# Altium project PROC114E3_SCH.PrjPcb (part 19 of 22)

## Sheet 37.SchDoc
size 513 x 386 mm
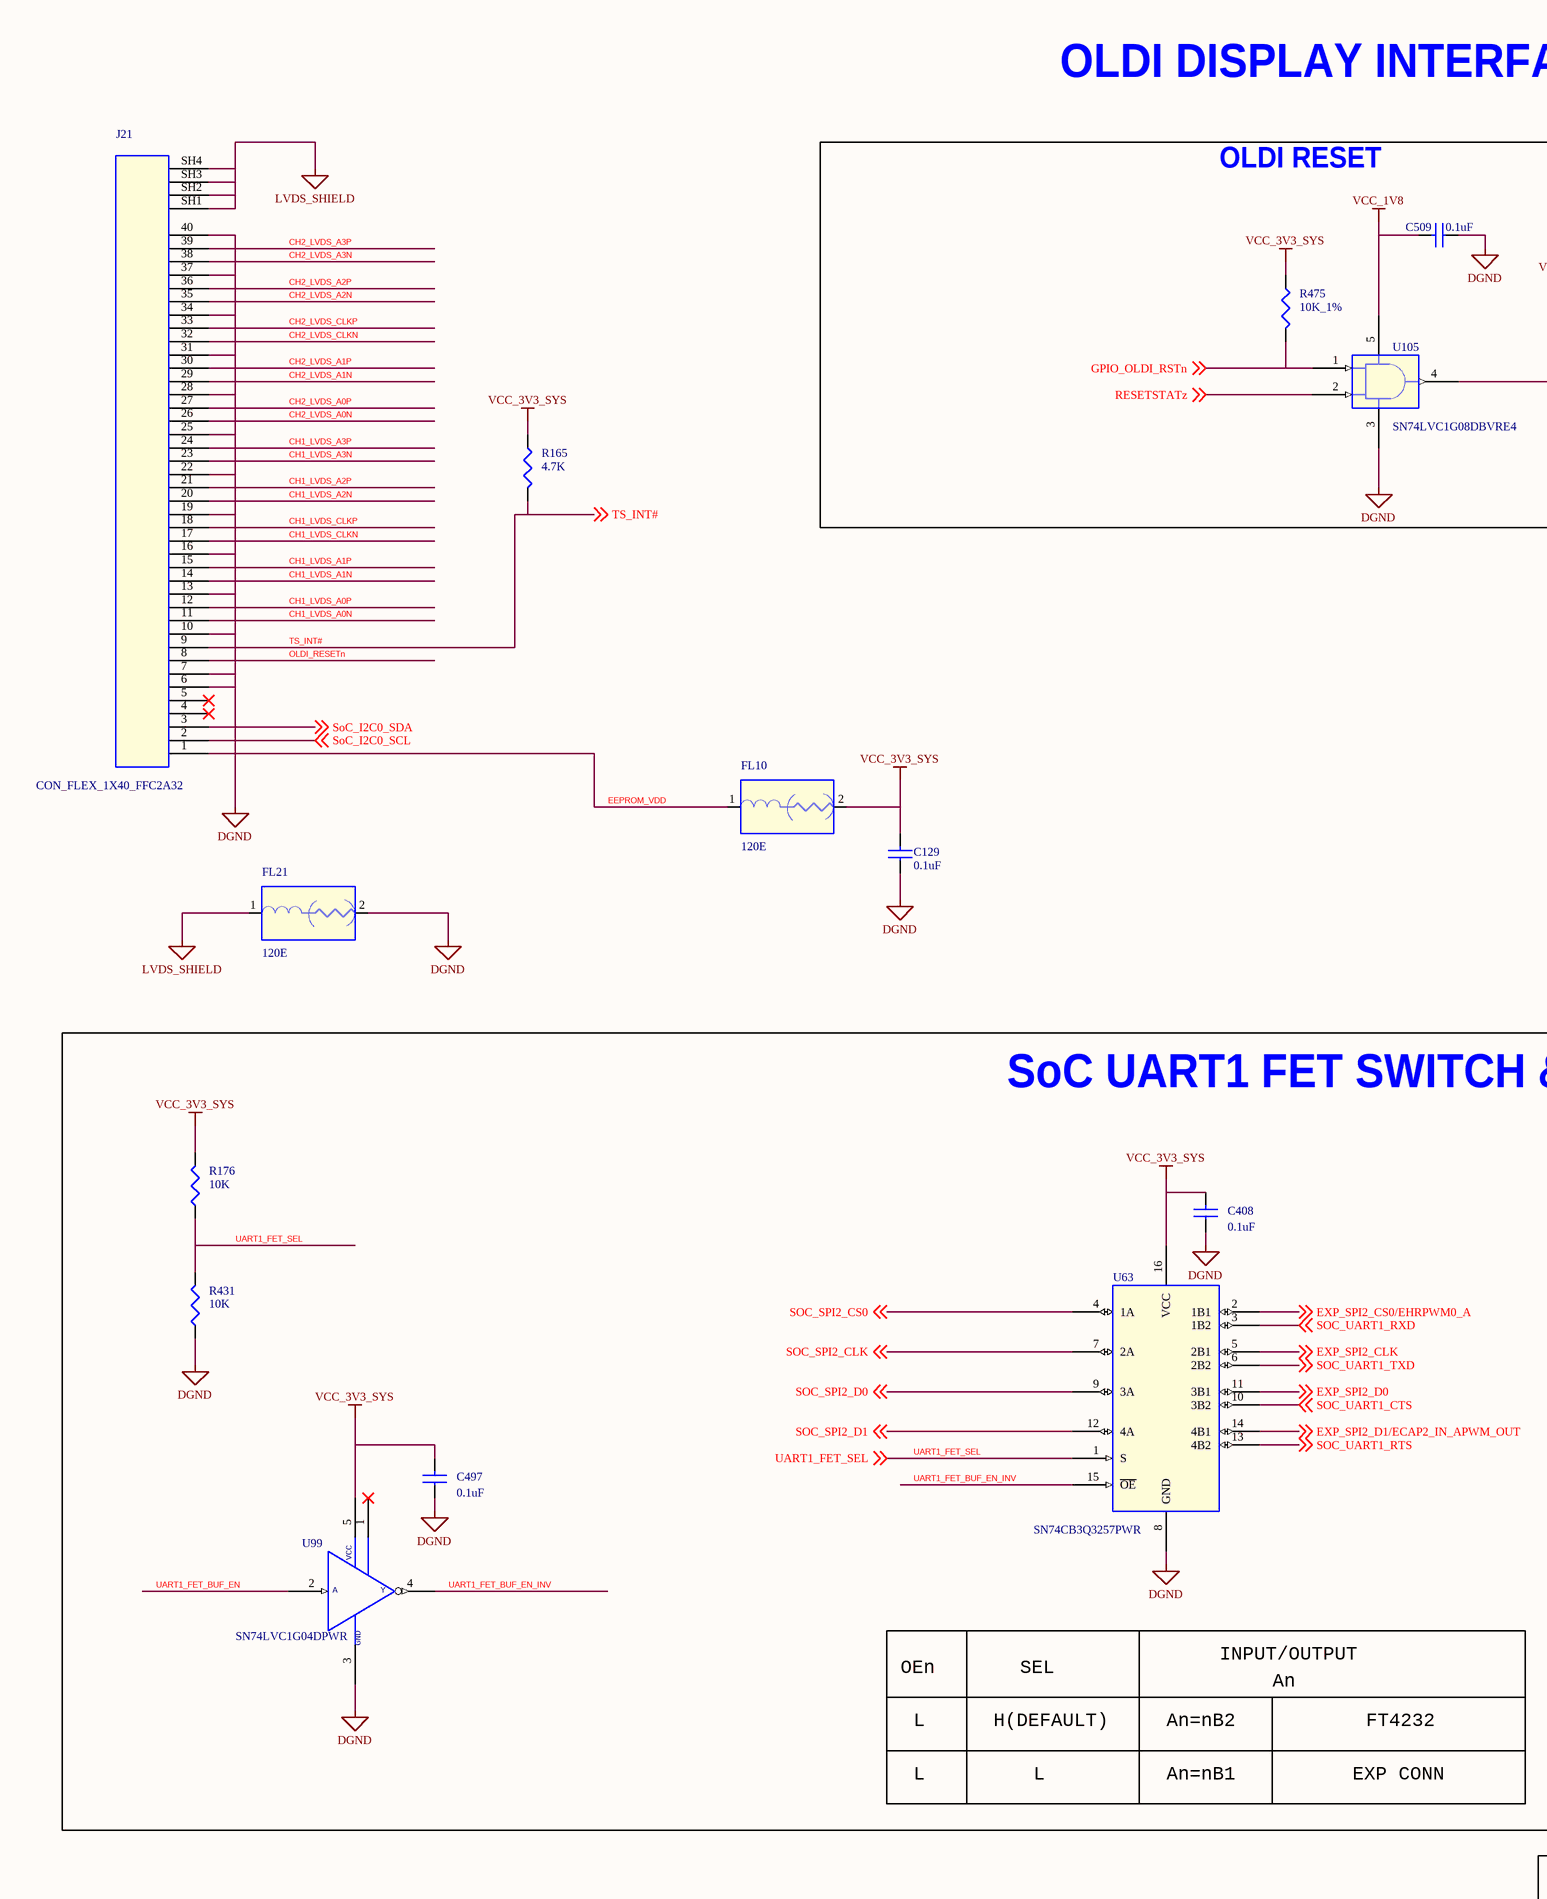
[diagram p66: 37.SchDoc, left]
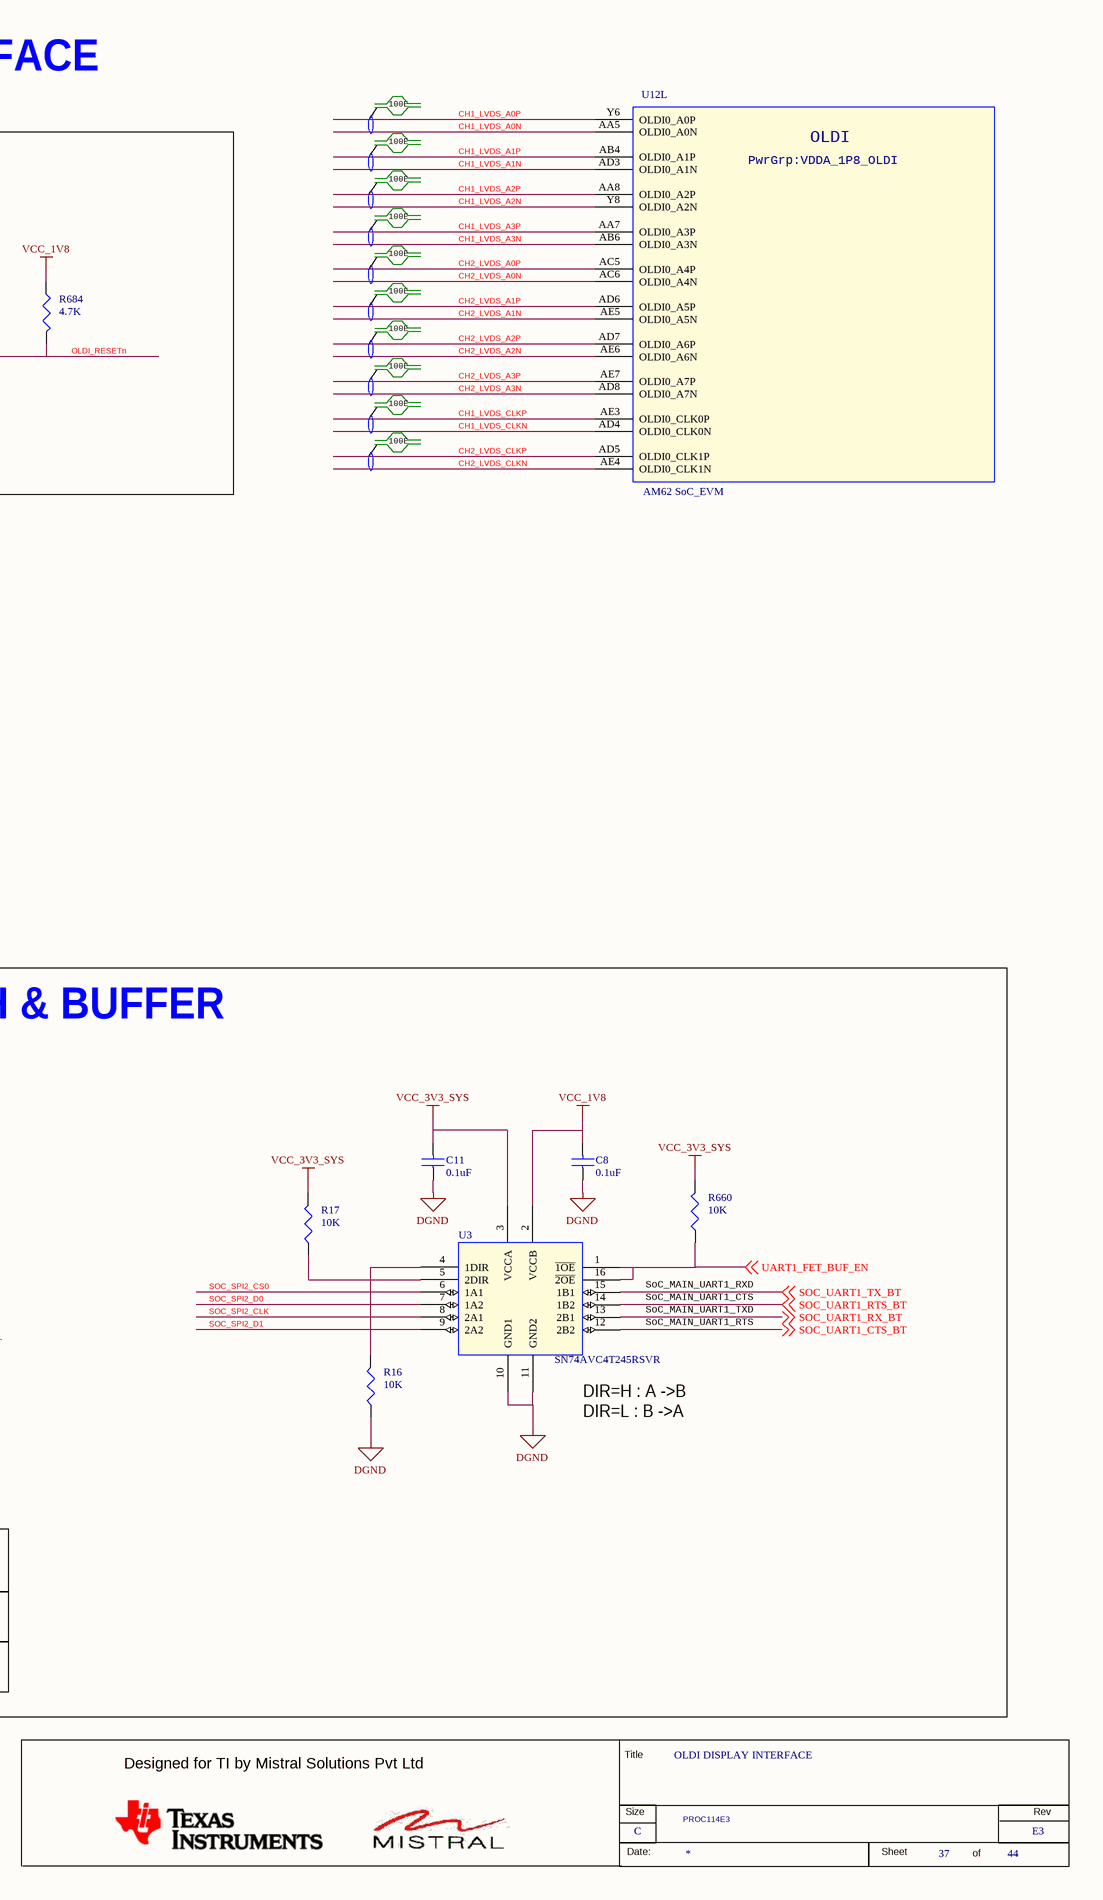
[diagram p67: 37.SchDoc, right]

### Parts
(Parts that share a designator on the sheet are numbered #1, #2 ... from top to bottom, then left to right.)
*#37  RevCode: E3  Title: OLDI DISPLAY INTERFACE  Page Size: C  Page Number: 37  Page Count: 44  Variant Name: PROC114E3  (hidden comment: MISTRAL_TITLEBLK_CSIZE)  (graphical)
C8  0.1uF  [CAP0201_0-5]
C11  0.1uF  [CAP0201_0-5]
C129  0.1uF  [CAP0201_0-5]
C408  0.1uF  [CAP0402_0-75]
C497  0.1uF  [CAP0201_0-5]
C509  0.1uF  [CAP0402_0-75]
FL10  120E  [EMIFIL_BLM15A_0402_0-6]
FL21  120E  [EMIFIL_BLM15A_0402_0-6]
J21  CON_FLEX_1X40_FFC2A32  [CON_FLEX1X40_FFC2A32-40-T_S_S_S_4-3]
R16  10K  [RES0201_0-5]
R17  10K  [RES0201_0-5]
R165  4.7K  [RES0201_0-5]
R176  10K  [RES0201_0-5]
R431  10K  [RES0201_0-5]
R475  10K_1%  [RES0201_0-5]
R660  10K  [RES0201_0-5]
R684  4.7K  [RES0201_0-5]
U3  SN74AVC4T245RSVR  [UQFN16_TMUX1574_70X100_0-6]
U12#2  AM62 SoC_EVM  [BGA425_19-68_510X510_0-7]  (part L of 18)
U63  SN74CB3Q3257PWR  [TSSOP16_25-59_205X180]
U99  SN74LVC1G04DPWR  [X2SON5_TLV7021_30X30_0-4]
U105  SN74LVC1G08DBVRE4  [SOT23-5]

### Blocks framed on the sheet
OLDI RESET: C509 R475 R684 U105
SoC UART1 FET SWITCH & BUFFER: C8 C11 C408 C497 R16 R17 R176 R431 R660 U3 U63 U99

### Nets
DGND: C8.1 C11.1 C129.1 C408.1 C497.1 C509.1 FL21.2 J21.6 J21.7 J21.10 J21.13 J21.16 J21.19 J21.22 J21.25 J21.28 J21.31 J21.34 J21.37 J21.40 R16.1 R431.1 U3.10(GND1) U3.11(GND2) U63.8(GND) U99.3(GND) U105.3(GND)
LVDS_SHIELD: FL21.1 J21.SH1 J21.SH2 J21.SH3 J21.SH4
VCC_1V8: C8.2 C509.2 R684.1 U3.2(VCCB) U105.5(VCC)
VCC_3V3_SYS: C11.2 C129.2 C408.2 C497.2 FL10.2 R17.2 R165.1 R176.2 R475.1 R660.2 U3.3(VCCA) U63.16(VCC) U99.5(VCC)
CH1_LVDS_A0N: J21.11 U12#2.AA5(OLDI0_A0N)
CH1_LVDS_A0P: J21.12 U12#2.Y6(OLDI0_A0P)
CH1_LVDS_A1N: J21.14 U12#2.AD3(OLDI0_A1N)
CH1_LVDS_A1P: J21.15 U12#2.AB4(OLDI0_A1P)
CH1_LVDS_A2N: J21.20 U12#2.Y8(OLDI0_A2N)
CH1_LVDS_A2P: J21.21 U12#2.AA8(OLDI0_A2P)
CH1_LVDS_A3N: J21.23 U12#2.AB6(OLDI0_A3N)
CH1_LVDS_A3P: J21.24 U12#2.AA7(OLDI0_A3P)
CH1_LVDS_CLKN: J21.17 U12#2.AD4(OLDI0_CLK0N)
CH1_LVDS_CLKP: J21.18 U12#2.AE3(OLDI0_CLK0P)
CH2_LVDS_A0N: J21.26 U12#2.AC6(OLDI0_A4N)
CH2_LVDS_A0P: J21.27 U12#2.AC5(OLDI0_A4P)
CH2_LVDS_A1N: J21.29 U12#2.AE5(OLDI0_A5N)
CH2_LVDS_A1P: J21.30 U12#2.AD6(OLDI0_A5P)
CH2_LVDS_A2N: J21.35 U12#2.AE6(OLDI0_A6N)
CH2_LVDS_A2P: J21.36 U12#2.AD7(OLDI0_A6P)
CH2_LVDS_A3N: J21.38 U12#2.AD8(OLDI0_A7N)
CH2_LVDS_A3P: J21.39 U12#2.AE7(OLDI0_A7P)
CH2_LVDS_CLKN: J21.32 U12#2.AE4(OLDI0_CLK1N)
CH2_LVDS_CLKP: J21.33 U12#2.AD5(OLDI0_CLK1P)
EEPROM_VDD: FL10.1 J21.1
EXP_SPI2_CLK: U63.5(2B1) ; off-sheet EXP_SPI2_CLK
EXP_SPI2_CS0/EHRPWM0_A: U63.2(1B1) ; off-sheet EXP_SPI2_CS0/EHRPWM0_A
EXP_SPI2_D0: U63.11(3B1) ; off-sheet EXP_SPI2_D0
EXP_SPI2_D1/ECAP2_IN_APWM_OUT: U63.14(4B1) ; off-sheet EXP_SPI2_D1/ECAP2_IN_APWM_OUT
GPIO_OLDI_RSTn: R475.2 U105.1(A) ; off-sheet GPIO_OLDI_RSTn
OLDI_RESETn: J21.8 R684.2 U105.4(Y)
RESETSTATz: U105.2(B) ; off-sheet RESETSTATz
SoC_I2C0_SCL: J21.2 ; off-sheet SoC_I2C0_SCL
SoC_I2C0_SDA: J21.3 ; off-sheet SoC_I2C0_SDA
SOC_SPI2_CLK: U3.8(2A1) U63.7(2A) ; off-sheet SOC_SPI2_CLK
SOC_SPI2_CS0: U3.6(1A1) U63.4(1A) ; off-sheet SOC_SPI2_CS0
SOC_SPI2_D0: U3.7(1A2) U63.9(3A) ; off-sheet SOC_SPI2_D0
SOC_SPI2_D1: U3.9(2A2) U63.12(4A) ; off-sheet SOC_SPI2_D1
SOC_UART1_CTS: U63.10(3B2) ; off-sheet SOC_UART1_CTS
SOC_UART1_CTS_BT: U3.12(2B2) ; off-sheet SOC_UART1_CTS_BT
SOC_UART1_RTS: U63.13(4B2) ; off-sheet SOC_UART1_RTS
SOC_UART1_RTS_BT: U3.14(1B2) ; off-sheet SOC_UART1_RTS_BT
SOC_UART1_RX_BT: U3.13(2B1) ; off-sheet SOC_UART1_RX_BT
SOC_UART1_RXD: U63.3(1B2) ; off-sheet SOC_UART1_RXD
SOC_UART1_TX_BT: U3.15(1B1) ; off-sheet SOC_UART1_TX_BT
SOC_UART1_TXD: U63.6(2B2) ; off-sheet SOC_UART1_TXD
TS_INT#: J21.9 R165.2 ; off-sheet TS_INT#
UART1_FET_BUF_EN: R660.1 U3.1(~{1OE}) U3.16(~{2OE}) U99.2(A) ; off-sheet UART1_FET_BUF_EN
UART1_FET_BUF_EN_INV: U63.15(~{OE}) U99.4(Y)
UART1_FET_SEL: R176.1 R431.2 U63.1(S) ; off-sheet UART1_FET_SEL
NetR16_2: R16.2 U3.4(1DIR)
NetR17_1: R17.1 U3.5(2DIR)

Not connected (* = marked no-connect by the designer): J21 4* 5*; U99 1(NC)*

### Notes on the sheet
- OLDI DISPLAY INTERFACE
- 100E
- SoC_MAIN_UART1_RXD
- SoC_MAIN_UART1_TXD
- SoC_MAIN_UART1_CTS
- SoC_MAIN_UART1_RTS
- (near U3) DIR=H : A ->B
  DIR=L : B ->A
- OEn
- SEL
- INPUT/OUTPUT
- An
- L
- H(DEFAULT)
- An=nB2
- FT4232
- An=nB1
- EXP CONN
- (in symbol AM62-EVM_BGA425, part L) OLDI; PwrGrp:VDDA_1P8_OLDI
- (in symbol MISTRAL_TITLEBLK_CSIZE) Title; Designed for TI by Mistral Solutions Pvt Ltd; Size; Rev; Date:; Sheet; of

### Library data of the parts
*#37 = MISTRAL_TITLEBLK_CSIZE: Issue: 1.0; Page Create Date: March  8, 1995; Page Modify Date: *; Schematic Page Count: 44; Schematic Page Number: 37
C8 C11 C129 = CAP_Dup2: CAP CERAMIC 0.1uF 16V 10% X5R 0201; Alt_Mfr_name: YAGEO AMERICA; Part_type: CAPACITORS\CERAMIC; Mfr_part_number: GRM033R61C104KE14D; Mfr_name: MURATA; Mistral Part No: 120009030072-R; Alt_Mfr_part_number: CC0402KRX5R8BB104; Custom_Duty: 15%; Customs_HS_Code: 85322990; Wattage: NA; Project: TI_MAXIE_CPB; Footprint Path: Y:\MIS_DATABASE\Library\ALTIUM_TOOL\PCB_FOOTPRINTS\Altium_Footprint_Lib.PcbLib; Library Path: Y:\MIS_DATABASE\Library\ALTIUM_TOOL\SCHEMATICS_PARTS\MS_DISCRETE_Library.schlib; Footprint Ref: CAP0201_0-5; Library Ref: CAP; MECHANICAL 3D STEP FILE: CAP0201_0-5; Chkd/date: MANIRAJA/230118; Crtd /date: MANIRAJA/230118; Datasheet: Y:\MIS_DATABASE\DATASHEETS\CAPACITORS\GRM033R61C104KE14.PDF; Temperature: -55°C+85°C; Weight: 0.33mg; Height: 0.33MM; Distributor_part_number: 490-14305-1-ND; Distributor_name: DIGIKEY; Package: 0201; Voltage: 16V; Tolerance: 10%; PCB Footprint: CAP0201_0-5
C408 C509 = CAP_Dup2: CAP CERAMIC 0.1uF 50V 10% X7R 0402; Alt_Mfr_part_number: CC0402KRX5R8BB104; Mistral Part No: 120011100014-R; Mfr_name: MURATA; Mfr_part_number: GRM155R71H104KE14D; Part_type: CAPACITORS\CERAMIC; Alt_Mfr_name: YAGEO AMERICA; Project: J7_CP; Wattage: NA; Customs_HS_Code: 85322990; Custom_Duty: 15%; Tolerance: 10%; Voltage: 50V; Package: 0402; Distributor_name: DIGIKEY; Distributor_part_number: 490-10700-1-ND; Height: 0.55MM; Weight: 3.1mg; Temperature: -55°C+125°C; Datasheet: Y:\MIS_DATABASE\DATASHEETS\CAPACITORS\GRM155R71H104KE14.PDF; Crtd /date: ALVY/211020; Chkd/date: MANIRAJA/261020; MECHANICAL 3D STEP FILE: CAP0402_0-75; Library Ref: CAP; Footprint Ref: CAP0402_0-75; Library Path: Y:\MIS_DATABASE\Library\ALTIUM_TOOL\SCHEMATICS_PARTS\MS_DISCRETE_Library.schlib; Footprint Path: Y:\MIS_DATABASE\Library\ALTIUM_TOOL\PCB_FOOTPRINTS\Altium_Footprint_Lib.PcbLib; PCB Footprint: CAP0402_0-75
C497 = CAP_Dup2: CAP CERAMIC 0.1uF 16V 10% X5R 0201; Alt_Mfr_part_number: CC0402KRX5R8BB104; Mistral Part No: 120009030072-R; Mfr_name: MURATA; Mfr_part_number: GRM033R61C104KE14D; Part_type: CAPACITORS\CERAMIC; Alt_Mfr_name: YAGEO AMERICA; Project: TI_MAXIE_CPB; Wattage: NA; Customs_HS_Code: 85322990; Custom_Duty: 15%; Tolerance: 10%; Voltage: 16V; Package: 0201; Distributor_name: DIGIKEY; Distributor_part_number: 490-14305-1-ND; Height: 0.33MM; Weight: 0.33mg; Temperature: -55°C+85°C; Datasheet: Y:\MIS_DATABASE\DATASHEETS\CAPACITORS\GRM033R61C104KE14.PDF; Crtd /date: MANIRAJA/230118; Chkd/date: MANIRAJA/230118; MECHANICAL 3D STEP FILE: CAP0201_0-5; Library Ref: CAP; Footprint Ref: CAP0201_0-5; Library Path: Y:\MIS_DATABASE\Library\ALTIUM_TOOL\SCHEMATICS_PARTS\MS_DISCRETE_Library.schlib; Footprint Path: Y:\MIS_DATABASE\Library\ALTIUM_TOOL\PCB_FOOTPRINTS\Altium_Footprint_Lib.PcbLib; PCB Footprint: CAP0201_0-5
FL10 FL21 = EMIFILTER_IND: IND FERRITE BEAD CHIP 120E 2A 0402; Mistral Part No: 130013060022-R; Mfr_name: MURATA; Mfr_part_number: BLM15PX121SN1D; Part_type: INDUCTOR; Project: GEN_3-8; Tolerance: 25%; Voltage: NA; Customs_HS_Code: 85369090; Custom_Duty: 24%; Footprint Ref: EMIFIL_BLM15A_0402_0-6; Wattage: NA; Package: 0402; Distributor_name: DIGIKEY; Distributor_part_number: 490-9656-1-ND; Library Ref: EMIFILTER_IND; Height: 0.55MM; Weight: 1mg; Temperature: -55°C+125°C; Datasheet: Y:\MIS_DATABASE\DATASHEETS\DISCRETES\INDUCTORS\BLM15-SN1-SER.PDF; Crtd /date: USMAN/170613; Chkd/date: NAVEED/241114; MECHANICAL 3D STEP FILE: EMIFIL_BLM15A_0402_0-6; Library Path: Y:\MIS_DATABASE\Library\ALTIUM_TOOL\SCHEMATICS_PARTS\MS_FILTER_Library.schlib; Footprint Path: Y:\MIS_DATABASE\Library\ALTIUM_TOOL\PCB_FOOTPRINTS\Altium_Footprint_Lib.PcbLib; PCB Footprint: EMIFIL_BLM15A_0402_0-6
J21 = CON_FLEX_40X1_SH4: CON FPC 1X40 0.50MM PITCH FEMALE ST SMD; Mistral Part No: 150021100004-R; Mfr_name: GCT; Mfr_part_number: FFC2A32-40-T; Part_type: CONNECTOR\FPC; Project: TI_AM62x SKEVM_BRD; Tolerance: NA; Customs_HS_Code: 85369090; Custom_Duty: 24%; Footprint Path: Y:\MIS_DATABASE\Library\ALTIUM_TOOL\PCB_FOOTPRINTS\Altium_Footprint_Lib.PcbLib; Library Path: Y:\MIS_DATABASE\Library\ALTIUM_TOOL\SCHEMATICS_PARTS\MS_CONNECTOR_Library.schlib; Footprint Ref: CON_FLEX1X40_FFC2A32-40-T_S_S_S_4-3; Voltage: NA; Wattage: NA; Package: SMD; Distributor_name: DIGIKEY; Distributor_part_number: 2073-FFC2A32-40-TCT-ND; Library Ref: CON_FLEX_40X1_SH4; Height: 4.25MM; Weight: 710mg; Temperature: -25°C+85°C; Datasheet: Y:\MIS_DATABASE\DATASHEETS\CONNECTORS\FFC2A32.PDF; Crtd /date: ALVY/041021; Chkd/date: MANIRAJA/061021; MECHANICAL 3D STEP FILE: CON_FLEX1X40_FFC2A32-40-T_S_S_S_4-3; PCB Footprint: CON_FLEX1X40_FFC2A32-40-T_S_S_S_4-3
R16 R17 = RESISTOR_Dup6: RES 10K 1/20W 5% 0201; Part_type: RESISTORS\FIXED; Mfr_part_number: RC0201JR-0710KL; Mfr_name: YAGEO AMERICA; Mistral Part No: 110010070051-R; Custom_Duty: 15%; Customs_HS_Code: 85332119; Voltage: NA; Project: GOLDEN-I LITE; MECHANICAL 3D STEP FILE: RES0201_0-5; Chkd/date: MANIRAJA/050517; Crtd /date: MANIRAJA/050517; Datasheet: Y:\MIS_DATABASE\DATASHEETS\RESISTORS\RCXXXXL-SER_MAR18.PDF; Temperature: -55°C+125°C; Weight: 0.17mg; Height: 0.26MM; Distributor_part_number: 311-10KNCT-ND; Distributor_name: DIGIKEY; Package: 0201; Wattage: 1/20W; Tolerance: 5%; Library Ref: RESISTOR; Footprint Ref: RES0201_0-5; Library Path: Y:\MIS_DATABASE\Library\ALTIUM_TOOL\SCHEMATICS_PARTS\MS_DISCRETE_Library.schlib; Footprint Path: Y:\MIS_DATABASE\Library\ALTIUM_TOOL\PCB_FOOTPRINTS\Altium_Footprint_Lib.PcbLib; PCB Footprint: RES0201_0-5
R165 R684 = RESISTOR_Dup6: RES 4.7K 1/20W 5% 0201; Mistral Part No: 110021090007-R; Mfr_name: YAGEO AMERICA; Mfr_part_number: RC0201JR-074K7L; Part_type: RESISTORS\FIXED; Project: TI_AM62x SKEVM_BRD; Voltage: NA; Customs_HS_Code: 85332119; Custom_Duty: 15%; Footprint Ref: RES0201_0-5; Tolerance: 5%; Wattage: 1/20W; Package: 0201; Distributor_name: DIGIKEY; Distributor_part_number: 311-4.7KNCT-ND; Library Ref: RESISTOR; Height: 0.26MM; Weight: 0.17mg; Temperature: -55°C+125°C; Datasheet: Y:\MIS_DATABASE\DATASHEETS\RESISTORS\RCXXXXL-SER_MAR18.PDF; Crtd /date: ALVY/200921; Chkd/date: MANIRAJA/200921; MECHANICAL 3D STEP FILE: RES0201_0-5; Library Path: Y:\MIS_DATABASE\Library\ALTIUM_TOOL\SCHEMATICS_PARTS\MS_DISCRETE_Library.schlib; Footprint Path: Y:\MIS_DATABASE\Library\ALTIUM_TOOL\PCB_FOOTPRINTS\Altium_Footprint_Lib.PcbLib; PCB Footprint: RES0201_0-5
R176 R431 R660 = RESISTOR_Dup6: RES 10K 1/20W 5% 0201; Mistral Part No: 110010070051-R; Mfr_name: YAGEO AMERICA; Mfr_part_number: RC0201JR-0710KL; Part_type: RESISTORS\FIXED; Project: GOLDEN-I LITE; Voltage: NA; Customs_HS_Code: 85332119; Custom_Duty: 15%; Footprint Ref: RES0201_0-5; Tolerance: 5%; Wattage: 1/20W; Package: 0201; Distributor_name: DIGIKEY; Distributor_part_number: 311-10KNCT-ND; Library Ref: RESISTOR; Height: 0.26MM; Weight: 0.17mg; Temperature: -55°C+125°C; Datasheet: Y:\MIS_DATABASE\DATASHEETS\RESISTORS\RCXXXXL-SER_MAR18.PDF; Crtd /date: MANIRAJA/050517; Chkd/date: MANIRAJA/050517; MECHANICAL 3D STEP FILE: RES0201_0-5; Library Path: Y:\MIS_DATABASE\Library\ALTIUM_TOOL\SCHEMATICS_PARTS\MS_DISCRETE_Library.schlib; Footprint Path: Y:\MIS_DATABASE\Library\ALTIUM_TOOL\PCB_FOOTPRINTS\Altium_Footprint_Lib.PcbLib; PCB Footprint: RES0201_0-5
R475 = RESISTOR_Dup6: RES 10K 1/20W 1% 0201; Part_type: RESISTORS\FIXED; Mfr_part_number: RC0201FR-0710KL; Mfr_name: YAGEO AMERICA; Mistral Part No: 110011040018-R; Custom_Duty: 15%; Customs_HS_Code: 85332119; Voltage: NA; Project: GOLDEN-I LITE; Footprint Path: Y:\MIS_DATABASE\Library\ALTIUM_TOOL\PCB_FOOTPRINTS\Altium_Footprint_Lib.PcbLib; Library Path: Y:\MIS_DATABASE\Library\ALTIUM_TOOL\SCHEMATICS_PARTS\MS_DISCRETE_Library.schlib; MECHANICAL 3D STEP FILE: RES0201_0-5; Chkd/date: VASANTHA/270117; Crtd /date: MANIRAJA/270117; Datasheet: Y:\MIS_DATABASE\DATASHEETS\RESISTORS\RCXXXXL-SER_MAR18.PDF; Temperature: -55°C+125°C; Weight: 0.17mg; Height: 0.26MM; Library Ref: RESISTOR; Distributor_part_number: 311-10.0KMCT-ND; Distributor_name: DIGIKEY; Package: 0201; Wattage: 1/20W; Tolerance: 1%; Footprint Ref: RES0201_0-5; PCB Footprint: RES0201_0-5
U3 = SN74AVC4T245RSV_UQFN16: IC 2-BIT BUS TRANSCEIVER WITH CONFIGURABLE VOLTAGE TRANSLATION AND 3 STATE O/P UQFN16; Mistral Part No: 141011040011-R; Mfr_name: TEXAS INSTRUMENTS; Part_type: ICS\DIGITAL\BUSTRANSCEIVER; Project: HMC; Tolerance: NA; Customs_HS_Code: 85423100; Custom_Duty: 15%; Footprint Ref: UQFN16_TMUX1574_70X100_0-6; Mfr_part_number: SN74AVC4T245RSVR; Voltage: NA; Wattage: NA; Package: UQFN16; Distributor_name: DIGIKEY; Distributor_part_number: 296-24366-1-ND; Library Ref: SN74AVC4T245RSV_UQFN16; Height: 0.55MM; Weight: 41mg; Temperature: -40°C+85°C; Datasheet: Y:\MIS_DATABASE\DATASHEETS\ICS\DIGITAL\BUSTRANSCEIVER\SN74AVC4T245-SER.PDF; Crtd /date: BAVISH/190411; Chkd/date: MANIRAJA/040520; MECHANICAL 3D STEP FILE: UQFN16_TMUX1574_70X100_0-6; Library Path: Y:\MIS_DATABASE\Library\ALTIUM_TOOL\SCHEMATICS_PARTS\MS_BUSDRIVERTRANSCEIVER_Library.schlib; Footprint Path: Y:\MIS_DATABASE\Library\ALTIUM_TOOL\PCB_FOOTPRINTS\Altium_Footprint_Lib.PcbLib; PCB Footprint: UQFN16_TMUX1574_70X100_0-6
U12#2 = AM62-EVM_BGA425: IC AM62 SoC MICROPROCESSOR BGA425; Mistral Part No: 141221060001; Mfr_name: TEXAS INSTRUMENTS; Part_type: ICS\DIGITAL\MICROPROCESSOR; Project: AM62_EVM_BRD; Tolerance: NA; Customs_HS_Code: 85423100; Custom_Duty: 15%; Mfr_part_number: AM62 SoC_EVM; Voltage: NA; Wattage: NA; Package: BGA425; Distributor_name: NA; Distributor_part_number: NA; Library Ref: AM62-EVM_BGA425; Footprint Ref: BGA425_19-68_510X510_0-7; Height: 0.65MM; Weight: NA; Temperature: NA; Datasheet: Y:\MIS_DATABASE\DATASHEETS\ICS\DIGITAL\MICROCONTROLLER\AM62-SoC_SVB.PDF; Crtd /date: MANIRAJA/110621; Chkd/date: ALVY/110621; RoHS: NA; MECHANICAL 3D STEP FILE: BGA425_19-68_510X510_0-7; Library Path: Y:\MIS_DATABASE\Library\ALTIUM_TOOL\SCHEMATICS_PARTS\MS_MICROPROCESSOR_Library.schlib; Footprint Path: Y:\MIS_DATABASE\Library\ALTIUM_TOOL\PCB_FOOTPRINTS\Altium_Footprint_Lib.PcbLib; PCB Footprint: BGA425_19-68_510X510_0-7
U63 = SN74CB3Q3257PWR_TSSOP16: IC 4BIT 1-OF-2 FET MULTIPLEXER/DEMULTIPLEXER TSSOP16; Mistral Part No: 141009030117-R; Mfr_name: TEXAS INSTRUMENTS; Part_type: ICS\DIGITAL\COMBINATIONAL; Project: OMAP_EVM; Customs_HS_Code: 85423100; Custom_Duty: 15%; Mfr_part_number: SN74CB3Q3257PWR; Package: TSSOP16; Distributor_name: DIGIKEY; Distributor_part_number: 296-19138-1-ND; Library Ref: SN74CB3Q3257PWR_TSSOP16; Height: 1.20MM; Temperature: -40°C+85°C; Datasheet: Y:\MIS_DATABASE\DATASHEETS\ICS\DIGITAL\COMBINATIONAL\SN74CB3Q3257.PDF; Crtd /date: USMAN/060109; Chkd/date: SUHAS/251010; RoHS: Sb/ Br FREE; PCB Footprint: TSSOP16_25-59_205X180
U99 = SN74LVC1G04DCKR_SC70-5: IC SINGLE INVERTER GATE X2SON5; Mistral Part No: 141020100010-R; Mfr_name: TEXAS INSTRUMENTS; Part_type: ICS\DIGITAL\GATES; Project: AM64X_SKEVM; Tolerance: NA; Customs_HS_Code: 85423100; Custom_Duty: 15%; Footprint Ref: X2SON5_TLV7021_30X30_0-4; Mfr_part_number: SN74LVC1G04DPWR; Voltage: NA; Wattage: NA; Package: X2SON5; Distributor_name: DIGIKEY; Distributor_part_number: 296-37758-1-ND; Library Ref: SN74LVC1G04DCKR_SC70-5; Height: 0.40MM; Weight: 0.6mg; Temperature: -40°C+125°C; Datasheet: Y:\MIS_DATABASE\DATASHEETS\ICS\DIGITAL\GATES\SN74LVC1G04XX.PDF; Crtd /date: ALVY/131020; Chkd/date: MANIRAJA/141020; MECHANICAL 3D STEP FILE: X2SON5_TLV7021_30X30_0-4; Library Path: Y:\MIS_DATABASE\Library\ALTIUM_TOOL\SCHEMATICS_PARTS\MS_GATE_Library.schlib; Footprint Path: Y:\MIS_DATABASE\Library\ALTIUM_TOOL\PCB_FOOTPRINTS\Altium_Footprint_Lib.PcbLib; PCB Footprint: X2SON5_TLV7021_30X30_0-4
U105 = SN74LVC1G08DBVRE4_SOT23-5_Dup1: IC SINGLE 2-INPUT POSITIVE AND GATE SOT23-5; Part_type: ICS\DIGITAL\GATES; Mfr_name: TEXAS INSTRUMENTS; Mistral Part No: 141009060026-R; Custom_Duty: 15%; Customs_HS_Code: 85423100; Project: KHAN_MAIN; RoHS: Sb/ Br FREE; Chkd/date: SUHAS/221010; Crtd /date: USMAN/151008; Datasheet: Y:\MIS_DATABASE\DATASHEETS\ICS\DIGITAL\GATES\SN74LVC1G08.PDF; Temperature: -40°C+85°C; Height: 1.45MM; Library Ref: SN74LVC1G08DBVRE4_SOT23-5; Distributor_part_number: SN74LVC1G08DBVRE4-ND; Distributor_name: DIGIKEY; Package: SOT23-5; Mfr_part_number: SN74LVC1G08DBVRE4; PCB Footprint: SOT23-5

## Sheet 38.SchDoc
size 513 x 386 mm
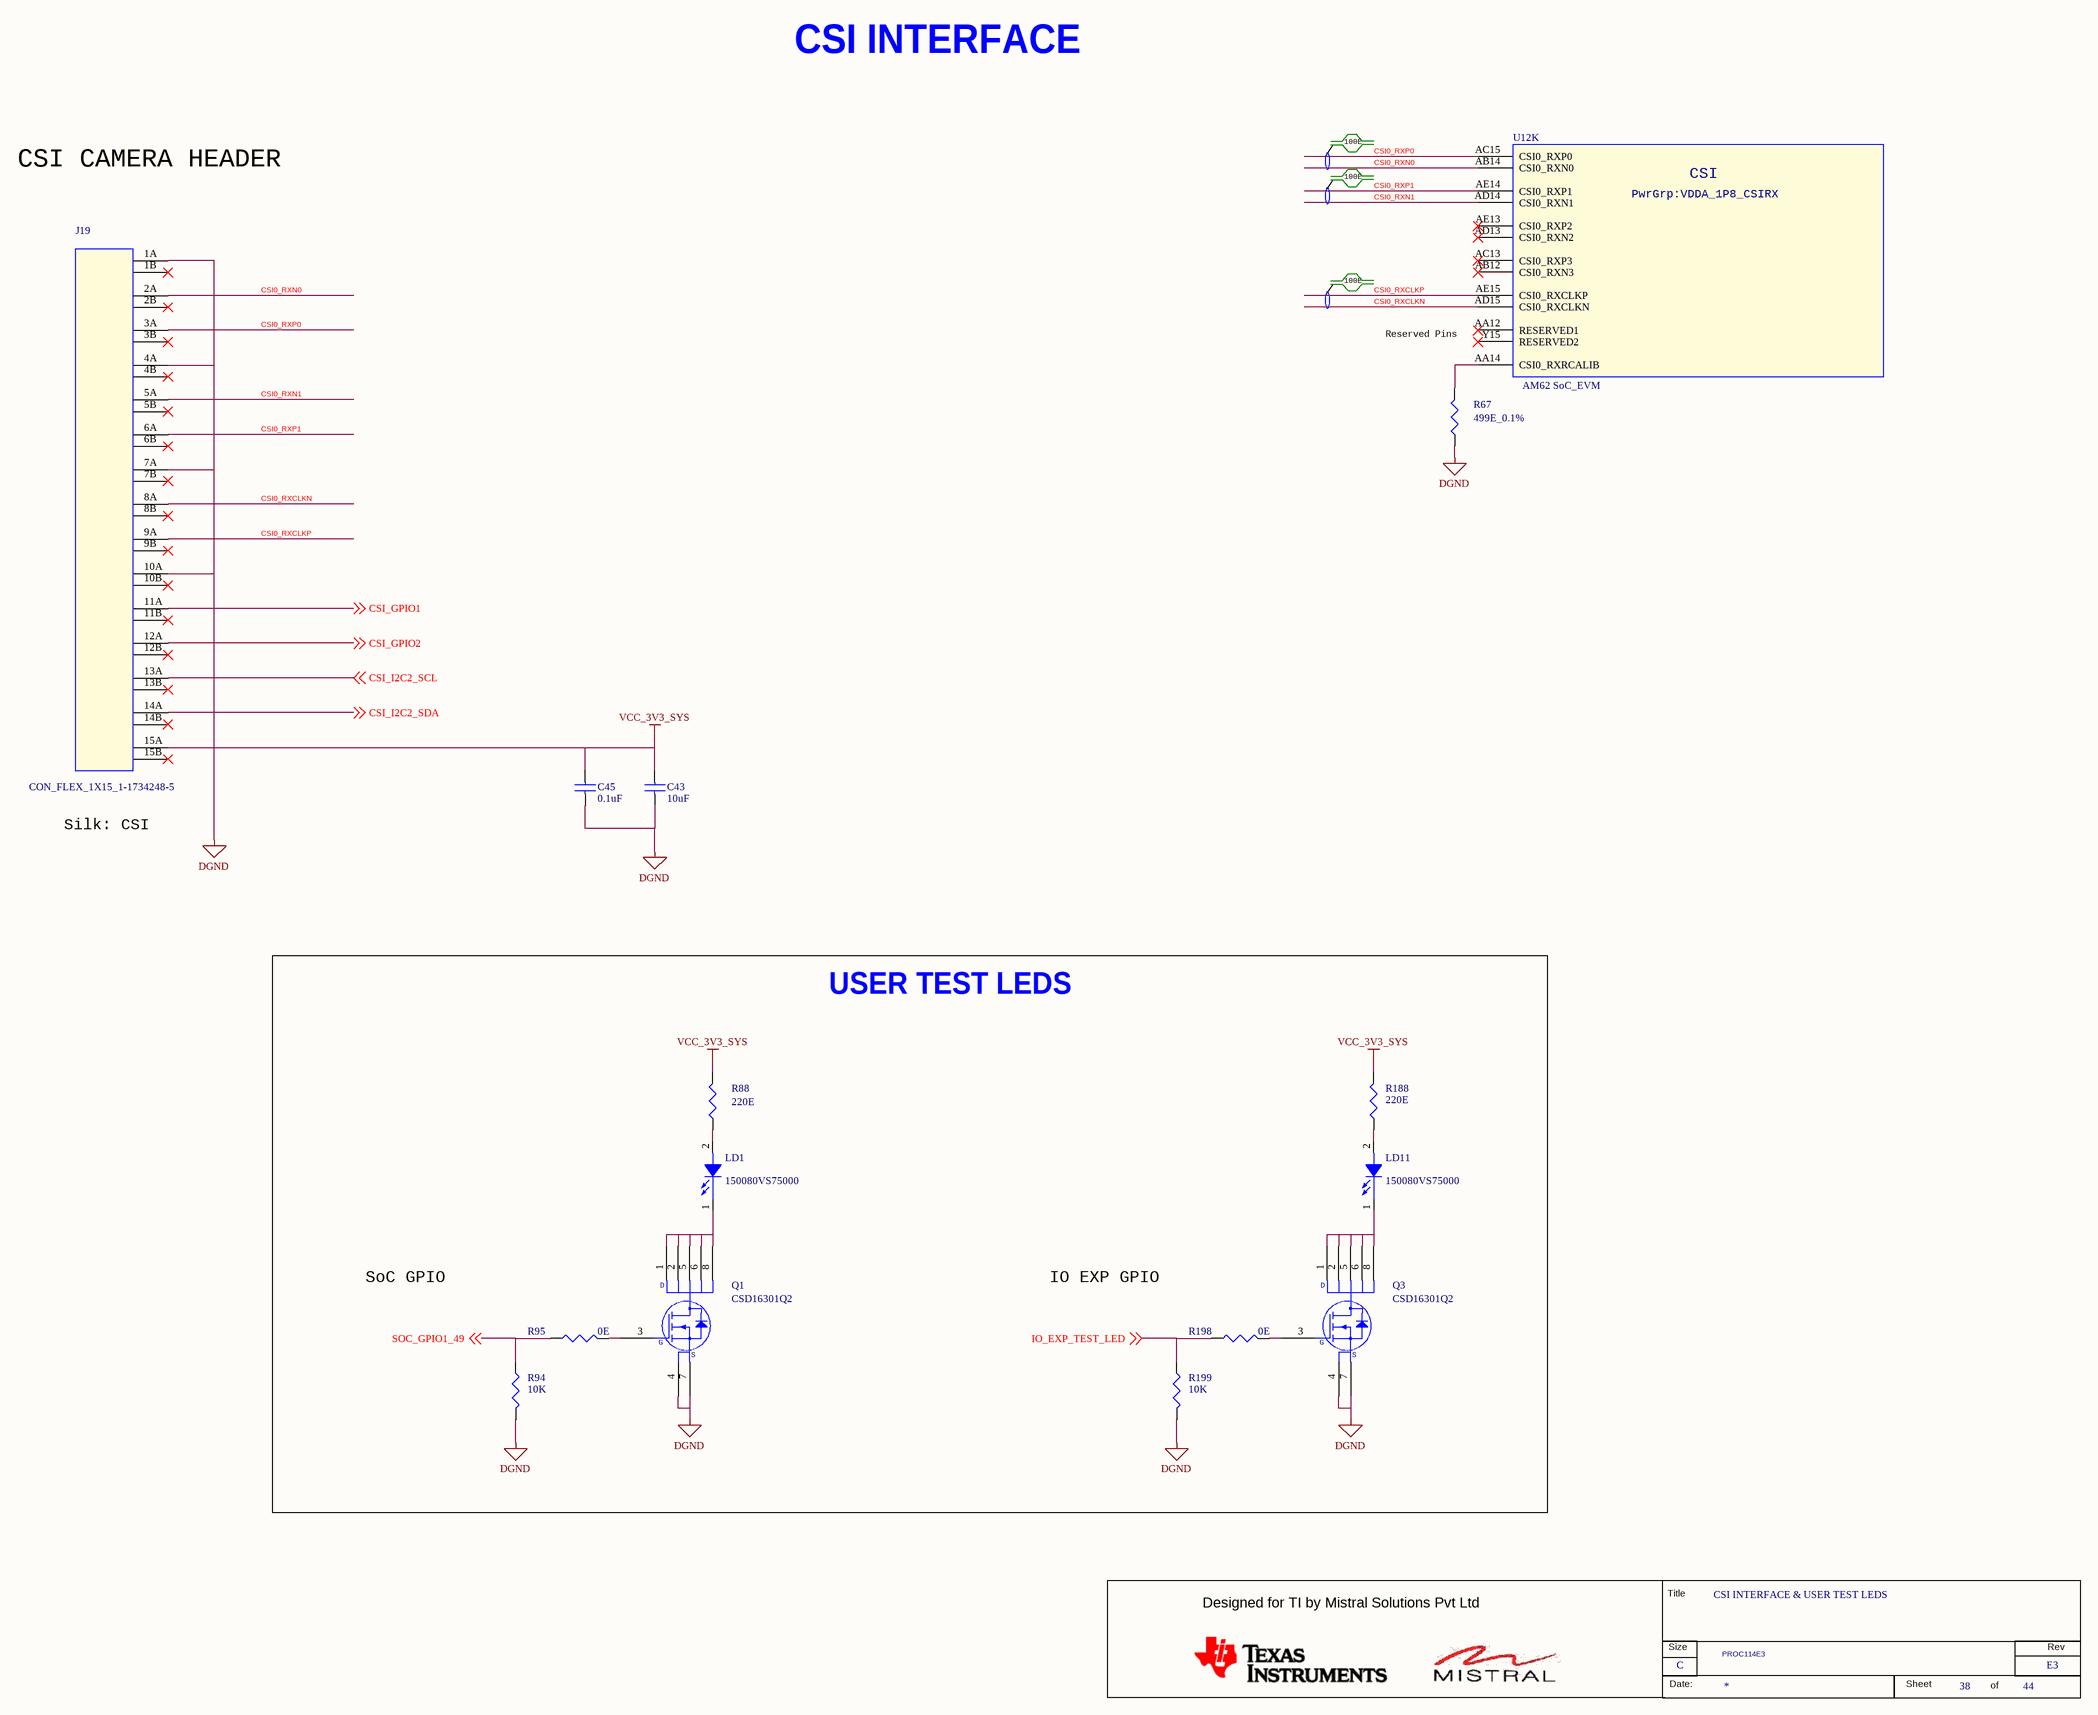
[diagram p68: 38.SchDoc]

### Parts
(Parts that share a designator on the sheet are numbered #1, #2 ... from top to bottom, then left to right.)
*#38  RevCode: E3  Title: CSI INTERFACE & USER TEST LEDS  Page Size: C  Page Number: 38  Page Count: 44  Variant Name: PROC114E3  (hidden comment: MISTRAL_TITLEBLK_CSIZE)  (graphical)
C43  10uF  [CAP0402_0-75]
C45  0.1uF  [CAP0402_0-75]
J19  CON_FLEX_1X15_1-1734248-5  [CON_FLEX1X15_1-1734248-5_S_S_S_7-7]
LD1  150080VS75000  [LED_150080VS75000_80X50_SMD_0-8]
LD11  150080VS75000  [LED_150080VS75000_80X50_SMD_0-8]
Q1  CSD16301Q2  [WSON6_CSD13202Q2_80X80_0-8]
Q3  CSD16301Q2  [WSON6_CSD13202Q2_80X80_0-8]
R67  499E_0.1%  [RES0402_0-5]
R88  220E  [RES0402_0-5]
R94  10K  [RES0201_0-5]
R95  0E  [RES0402_0-5]
R188  220E  [RES0402_0-5]
R198  0E  [RES0402_0-5]
R199  10K  [RES0201_0-5]
U12#2  AM62 SoC_EVM  [BGA425_19-68_510X510_0-7]  (part K of 18)

### Blocks framed on the sheet
USER TEST LEDS: LD1 LD11 Q1 Q3 R88 R94 R95 R188 R198 R199

### Nets
DGND: C43.2 C45.2 J19.1A J19.4A J19.7A J19.10A Q1.4(S1) Q1.7(S2) Q3.4(S1) Q3.7(S2) R67.1 R94.1 R199.1
VCC_3V3_SYS: C43.1 C45.1 J19.15A R88.2 R188.2
CSI0_RXCLKN: J19.8A U12#2.AD15(CSI0_RXCLKN)
CSI0_RXCLKP: J19.9A U12#2.AE15(CSI0_RXCLKP)
CSI0_RXN0: J19.2A U12#2.AB14(CSI0_RXN0)
CSI0_RXN1: J19.5A U12#2.AD14(CSI0_RXN1)
CSI0_RXP0: J19.3A U12#2.AC15(CSI0_RXP0)
CSI0_RXP1: J19.6A U12#2.AE14(CSI0_RXP1)
CSI_GPIO1: J19.11A ; off-sheet CSI_GPIO1
CSI_GPIO2: J19.12A ; off-sheet CSI_GPIO2
CSI_I2C2_SCL: J19.13A ; off-sheet CSI_I2C2_SCL
CSI_I2C2_SDA: J19.14A ; off-sheet CSI_I2C2_SDA
IO_EXP_TEST_LED: R198.1 R199.2 ; off-sheet IO_EXP_TEST_LED
SOC_GPIO1_49: R94.2 R95.1 ; off-sheet SOC_GPIO1_49
NetLD1_1: LD1.1(CATHODE) Q1.1(D1) Q1.2(D2) Q1.5(D3) Q1.6(D4) Q1.8(D5)
NetLD1_2: LD1.2(ANODE) R88.1
NetLD11_1: LD11.1(CATHODE) Q3.1(D1) Q3.2(D2) Q3.5(D3) Q3.6(D4) Q3.8(D5)
NetLD11_2: LD11.2(ANODE) R188.1
NetQ1_3: Q1.3(G) R95.2
NetQ3_3: Q3.3(G) R198.2
NetR67_2: R67.2 U12#2.AA14(CSI0_RXRCALIB)

Not connected (* = marked no-connect by the designer): J19 1B* 2B* 3B* 4B* 5B* 6B* 7B* 8B* 9B* 10B* 11B* 12B* 13B* 14B* 15B*; U12#2 AA12(RESERVED1)* AB12(CSI0_RXN3)* AC13(CSI0_RXP3)* AD13(CSI0_RXN2)* AE13(CSI0_RXP2)* Y15(RESERVED2)*

### Notes on the sheet
- CSI INTERFACE
- 100E
- CSI CAMERA HEADER
- Reserved Pins
- Silk: CSI
- SoC GPIO
- IO EXP GPIO
- (in symbol AM62-EVM_BGA425, part K) CSI; PwrGrp:VDDA_1P8_CSIRX
- (in symbol MISTRAL_TITLEBLK_CSIZE) Title; Designed for TI by Mistral Solutions Pvt Ltd; Size; Rev; Date:; Sheet; of
- (in symbol MOSFET_CSD17313Q2) D; S

### Library data of the parts
*#38 = MISTRAL_TITLEBLK_CSIZE: Issue: 1.0; Page Create Date: March  8, 1995; Page Modify Date: *; Schematic Page Count: 44; Schematic Page Number: 38
C43 = CAP_Dup2: CAP CERAMIC 10uF 10V 20% X5R 0402; Mistral Part No: 120013110019-R; Mfr_name: MURATA; Mfr_part_number: GRM155R61A106ME11D; Part_type: CAPACITORS\CERAMIC; Project: QCS610_NANOSOM; Wattage: NA; Customs_HS_Code: 85322990; Custom_Duty: 15%; PCB Footprint: CAP0402_0-75; Tolerance: 20%; Voltage: 10V; Package: 0402; Distributor_name: DIGIKEY; Distributor_part_number: 490-GRM155R61A106ME11DTR-ND; Library Ref: CAP; Footprint Ref: CAP0402_0-75; Height: 0.55MM; Weight: 3.1mg; Temperature: -55°C+85°C; Datasheet: Y:\MIS_DATABASE\DATASHEETS\CAPACITORS\MURATA-GXX-SER_NOV17.PDF; Crtd /date: ALVY/260520; Chkd/date: MANIRAJA/300520; MECHANICAL 3D STEP FILE: CAP0402_0-75; Library Path: Y:\MIS_DATABASE\Library\ALTIUM_TOOL\SCHEMATICS_PARTS\MS_DISCRETE_Library.schlib; Footprint Path: Y:\MIS_DATABASE\Library\ALTIUM_TOOL\PCB_FOOTPRINTS\Altium_Footprint_Lib.PcbLib
C45 = CAP_Dup2: CAP CERAMIC 0.1uF 50V 10% X7R 0402; Alt_Mfr_name: YAGEO AMERICA; Part_type: CAPACITORS\CERAMIC; Mfr_part_number: GRM155R71H104KE14D; Mfr_name: MURATA; Mistral Part No: 120011100014-R; Alt_Mfr_part_number: CC0402KRX5R8BB104; Custom_Duty: 15%; Customs_HS_Code: 85322990; Wattage: NA; Project: J7_CP; PCB Footprint: CAP0402_0-75; Footprint Path: Y:\MIS_DATABASE\Library\ALTIUM_TOOL\PCB_FOOTPRINTS\Altium_Footprint_Lib.PcbLib; Library Path: Y:\MIS_DATABASE\Library\ALTIUM_TOOL\SCHEMATICS_PARTS\MS_DISCRETE_Library.schlib; Footprint Ref: CAP0402_0-75; Library Ref: CAP; MECHANICAL 3D STEP FILE: CAP0402_0-75; Chkd/date: MANIRAJA/261020; Crtd /date: ALVY/211020; Datasheet: Y:\MIS_DATABASE\DATASHEETS\CAPACITORS\GRM155R71H104KE14.PDF; Temperature: -55°C+125°C; Weight: 3.1mg; Height: 0.55MM; Distributor_part_number: 490-10700-1-ND; Distributor_name: DIGIKEY; Package: 0402; Voltage: 50V; Tolerance: 10%
J19 = CON_FLEX_15X1_1-1734248-5: CON FPC 1X15 1.00MM PITCH FEMALE ST SMD; Part_type: CONNECTOR\FPC; Mfr_name: TE CONNECTIVITY; Mistral Part No: 150020060004-R; Custom_Duty: 24%; Customs_HS_Code: 85369090; Wattage: NA; Project: JETSON_CARRIER_BRD; PCB Footprint: CON_FLEX1X15_1-1734248-5_S_S_S_7-7; Footprint Path: Y:\MIS_DATABASE\Library\ALTIUM_TOOL\PCB_FOOTPRINTS\Altium_Footprint_Lib.PcbLib; Library Path: Y:\MIS_DATABASE\Library\ALTIUM_TOOL\SCHEMATICS_PARTS\MS_CONNECTOR_Library.schlib; MECHANICAL 3D STEP FILE: CON_FLEX1X15_1-1734248-5_S_S_S_7-7; Chkd/date: ALVY/030620; Crtd /date: ALVY/030620; Datasheet: Y:\MIS_DATABASE\DATASHEETS\CONNECTORS\1734248.PDF; Temperature: -20°C+85°C; Weight: 612mg; Height: 7.70MM; Footprint Ref: CON_FLEX1X15_1-1734248-5_S_S_S_7-7; Library Ref: CON_FLEX_15X1_1-1734248-5; Distributor_part_number: A101418CT-ND; Distributor_name: DIGIKEY; Package: SMD; Voltage: NA; Tolerance: NA; Mfr_part_number: 1-1734248-5
LD1 = DIODE_LED: DIODE LED BRIGHT GREEN SMD; Mistral Part No: 130020080012-R; Mfr_name: WURTH ELECTRONICS; Part_type: OPTO\LED; Project: AM64x_EVM_BRD; Tolerance: NA; Customs_HS_Code: 85439000; Custom_Duty: 24%; Footprint Ref: LED_150080VS75000_80X50_SMD_0-8; Mfr_part_number: 150080VS75000; Voltage: NA; Wattage: NA; Package: SMD; Distributor_name: DIGIKEY; Distributor_part_number: 732-4986-1-ND; Library Ref: DIODE_LED; Height: 0.80MM; Weight: 10mg; Temperature: -40°C+85°C; Datasheet: Y:\MIS_DATABASE\DATASHEETS\DISCRETES\LEDS\150080VS75000.PDF; Crtd /date: ALVY/180820; Chkd/date: MANIRAJA/180820; MECHANICAL 3D STEP FILE: LED_150080VS75000_80X50_SMD_0-8; Library Path: Y:\MIS_DATABASE\Library\ALTIUM_TOOL\SCHEMATICS_PARTS\MS_OPTO_Library.schlib; Footprint Path: Y:\MIS_DATABASE\Library\ALTIUM_TOOL\PCB_FOOTPRINTS\Altium_Footprint_Lib.PcbLib; PCB Footprint: LED_150080VS75000_80X50_SMD_0-8
LD11 = DIODE_LED: DIODE LED BRIGHT GREEN SMD; Part_type: OPTO\LED; Mfr_name: WURTH ELECTRONICS; Mistral Part No: 130020080012-R; Custom_Duty: 24%; Customs_HS_Code: 85439000; Wattage: NA; Project: AM64x_EVM_BRD; Footprint Path: Y:\MIS_DATABASE\Library\ALTIUM_TOOL\PCB_FOOTPRINTS\Altium_Footprint_Lib.PcbLib; Library Path: Y:\MIS_DATABASE\Library\ALTIUM_TOOL\SCHEMATICS_PARTS\MS_OPTO_Library.schlib; MECHANICAL 3D STEP FILE: LED_150080VS75000_80X50_SMD_0-8; Chkd/date: MANIRAJA/180820; Crtd /date: ALVY/180820; Datasheet: Y:\MIS_DATABASE\DATASHEETS\DISCRETES\LEDS\150080VS75000.PDF; Temperature: -40°C+85°C; Weight: 10mg; Height: 0.80MM; Library Ref: DIODE_LED; Distributor_part_number: 732-4986-1-ND; Distributor_name: DIGIKEY; Package: SMD; Voltage: NA; Tolerance: NA; Mfr_part_number: 150080VS75000; Footprint Ref: LED_150080VS75000_80X50_SMD_0-8; PCB Footprint: LED_150080VS75000_80X50_SMD_0-8
Q1 Q3 = MOSFET_CSD17313Q2: IC MOSFET N-CHANNEL NEXFET 25V WSON6; Part_type: ICS\POWER\MOSFET; Mfr_name: TEXAS INSTRUMENTS; Mistral Part No: 142020120008-R; Custom_Duty: 15%; Customs_HS_Code: 85423100; Wattage: NA; Project: TI_AM243x LP EVM; Footprint Path: Y:\MIS_DATABASE\Library\ALTIUM_TOOL\PCB_FOOTPRINTS\Altium_Footprint_Lib.PcbLib; Library Path: Y:\MIS_DATABASE\Library\ALTIUM_TOOL\SCHEMATICS_PARTS\MS_MOSFET_Library.schlib; MECHANICAL 3D STEP FILE: WSON6_CSD13202Q2_80X80_0-8; Chkd/date: ALVY/071220; Crtd /date: MANIRAJA/071220; Datasheet: Y:\MIS_DATABASE\DATASHEETS\ICS\POWER\CSD16301Q2.PDF; Temperature: -55°C+150°C; Weight: 8.7mg; Height: 0.80MM; PCB Footprint: WSON6_CSD13202Q2_80X80_0-8; Library Ref: MOSFET_CSD17313Q2; Distributor_part_number: 296-25260-1-ND; Distributor_name: DIGIKEY; Package: WSON6; Voltage: NA; Tolerance: NA; Mfr_part_number: CSD16301Q2; Footprint Ref: WSON6_CSD13202Q2_80X80_0-8
R67 = RESISTOR_Dup6: RES 499E 1/16W 0.1% 0402; Mistral Part No: 110021020006-R; Mfr_name: YAGEO AMERICA; Mfr_part_number: RT0402BRD07499RL; Part_type: RESISTORS\FIXED; Project: TI_AM62x SKEVM_BRD; Voltage: NA; Customs_HS_Code: 85332119; Custom_Duty: 15%; PCB Footprint: RES0402_0-5; Tolerance: 0.1%; Wattage: 1/16W; Package: 0402; Distributor_name: DIGIKEY; Distributor_part_number: YAG1440CT-ND; Library Ref: RESISTOR; Footprint Ref: RES0402_0-5; Height: 0.35MM; Weight: 0.65mg; Temperature: -55°C+155°C; Datasheet: Y:\MIS_DATABASE\DATASHEETS\RESISTORS\YAGEO_RT-SERIES.PDF; Crtd /date: MANIRAJA/200921; Chkd/date: ALVY/200921; MECHANICAL 3D STEP FILE: RES0402_0-5; Library Path: Y:\MIS_DATABASE\Library\ALTIUM_TOOL\SCHEMATICS_PARTS\MS_DISCRETE_Library.schlib; Footprint Path: Y:\MIS_DATABASE\Library\ALTIUM_TOOL\PCB_FOOTPRINTS\Altium_Footprint_Lib.PcbLib
R88 = RESISTOR_Dup6: RES 220E 1/10W 5% 0402; Part_type: RESISTORS\FIXED; Mfr_part_number: ERJ-2GEJ221X; Mfr_name: PANASONIC-ECG; Mistral Part No: 110009030506-R; Voltage: NA; Custom_Duty: 15%; Customs_HS_Code: 85332119; Project: RED EYE; Footprint Path: Y:\MIS_DATABASE\Library\ALTIUM_TOOL\PCB_FOOTPRINTS\Altium_Footprint_Lib.PcbLib; Library Path: Y:\MIS_DATABASE\Library\ALTIUM_TOOL\SCHEMATICS_PARTS\MS_DISCRETE_Library.schlib; MECHANICAL 3D STEP FILE: RES0402_0-5; Temperature: -55°C+155°C; Weight: 0.8mg; Library Ref: RESISTOR; Chkd/date: VASANTHA/291216; Crtd /date: GEETHA/260406; Datasheet: Y:\MIS_DATABASE\DATASHEETS\RESISTORS\PAN-ERJSER_NOV17.PDF; Height: 0.40MM; Distributor_part_number: P220JCT-ND; Distributor_name: DIGIKEY; Package: 0402; Wattage: 1/10W; Tolerance: 5%; Footprint Ref: RES0402_0-5; PCB Footprint: RES0402_0-5
R94 R199 = RESISTOR_Dup6: as R176 on sheet 37; Footprint Path: Y:\MIS_DATABASE\Library\ALTIUM_TOOL\PCB_FOOTPRINTS\Altium_Footprint_Lib.PcbLib; Library Path: Y:\MIS_DATABASE\Library\ALTIUM_TOOL\SCHEMATICS_PARTS\MS_DISCRETE_Library.schlib; Footprint Ref: RES0201_0-5; Library Ref: RESISTOR; Tolerance: 5%; Wattage: 1/20W; Package: 0201; Distributor_name: DIGIKEY; Distributor_part_number: 311-10KNCT-ND; Height: 0.26MM; Weight: 0.17mg; Temperature: -55°C+125°C; Datasheet: Y:\MIS_DATABASE\DATASHEETS\RESISTORS\RCXXXXL-SER_MAR18.PDF; Crtd /date: MANIRAJA/050517; Chkd/date: MANIRAJA/050517; MECHANICAL 3D STEP FILE: RES0201_0-5; PCB Footprint: RES0201_0-5
R95 R198 = RESISTOR_Dup6: RES 0E 1/16W JUMPER 0402; Part_type: RESISTORS\FIXED; Mfr_part_number: CRCW04020000Z0ED; Mfr_name: VISHAY; Mistral Part No: 110010080019-R; Custom_Duty: 15%; Customs_HS_Code: 85332119; Voltage: NA; Project: PB_BUGBASE; Footprint Path: Y:\MIS_DATABASE\Library\ALTIUM_TOOL\PCB_FOOTPRINTS\Altium_Footprint_Lib.PcbLib; Library Path: Y:\MIS_DATABASE\Library\ALTIUM_TOOL\SCHEMATICS_PARTS\MS_DISCRETE_Library.schlib; MECHANICAL 3D STEP FILE: RES0402_0-5; Chkd/date: VASANTHA/201216; Crtd /date: MUDDU/190810; Datasheet: Y:\MIS_DATABASE\DATASHEETS\RESISTORS\CRCW0603.PDF; Temperature: -55°C+155°C; Weight: 0.65mg; Height: 0.40MM; Library Ref: RESISTOR; Distributor_part_number: 541-0.0JCT-ND; Distributor_name: DIGIKEY; Package: 0402; Wattage: 1/16W; Tolerance: NA; Footprint Ref: RES0402_0-5; PCB Footprint: RES0402_0-5
R188 = RESISTOR_Dup6: RES 220E 1/10W 5% 0402; Mistral Part No: 110009030506-R; Mfr_name: PANASONIC-ECG; Mfr_part_number: ERJ-2GEJ221X; Part_type: RESISTORS\FIXED; Project: RED EYE; Customs_HS_Code: 85332119; Custom_Duty: 15%; Voltage: NA; Footprint Ref: RES0402_0-5; Tolerance: 5%; Wattage: 1/10W; Package: 0402; Distributor_name: DIGIKEY; Distributor_part_number: P220JCT-ND; Height: 0.40MM; Datasheet: Y:\MIS_DATABASE\DATASHEETS\RESISTORS\PAN-ERJSER_NOV17.PDF; Crtd /date: GEETHA/260406; Chkd/date: VASANTHA/291216; Library Ref: RESISTOR; Weight: 0.8mg; Temperature: -55°C+155°C; MECHANICAL 3D STEP FILE: RES0402_0-5; Library Path: Y:\MIS_DATABASE\Library\ALTIUM_TOOL\SCHEMATICS_PARTS\MS_DISCRETE_Library.schlib; Footprint Path: Y:\MIS_DATABASE\Library\ALTIUM_TOOL\PCB_FOOTPRINTS\Altium_Footprint_Lib.PcbLib; PCB Footprint: RES0402_0-5
U12#2 = AM62-EVM_BGA425: as U12#2 on sheet 37; PCB Footprint: BGA425_19-68_510X510_0-7; Mfr_part_number: AM62 SoC_EVM; Voltage: NA; Wattage: NA; Package: BGA425; Distributor_name: NA; Distributor_part_number: NA; Library Ref: AM62-EVM_BGA425; Footprint Ref: BGA425_19-68_510X510_0-7; Height: 0.65MM; Weight: NA; Temperature: NA; Datasheet: Y:\MIS_DATABASE\DATASHEETS\ICS\DIGITAL\MICROCONTROLLER\AM62-SoC_SVB.PDF; Crtd /date: MANIRAJA/110621; Chkd/date: ALVY/110621; RoHS: NA; MECHANICAL 3D STEP FILE: BGA425_19-68_510X510_0-7; Library Path: Y:\MIS_DATABASE\Library\ALTIUM_TOOL\SCHEMATICS_PARTS\MS_MICROPROCESSOR_Library.schlib; Footprint Path: Y:\MIS_DATABASE\Library\ALTIUM_TOOL\PCB_FOOTPRINTS\Altium_Footprint_Lib.PcbLib

## Sheet 39.SchDoc
size 513 x 386 mm
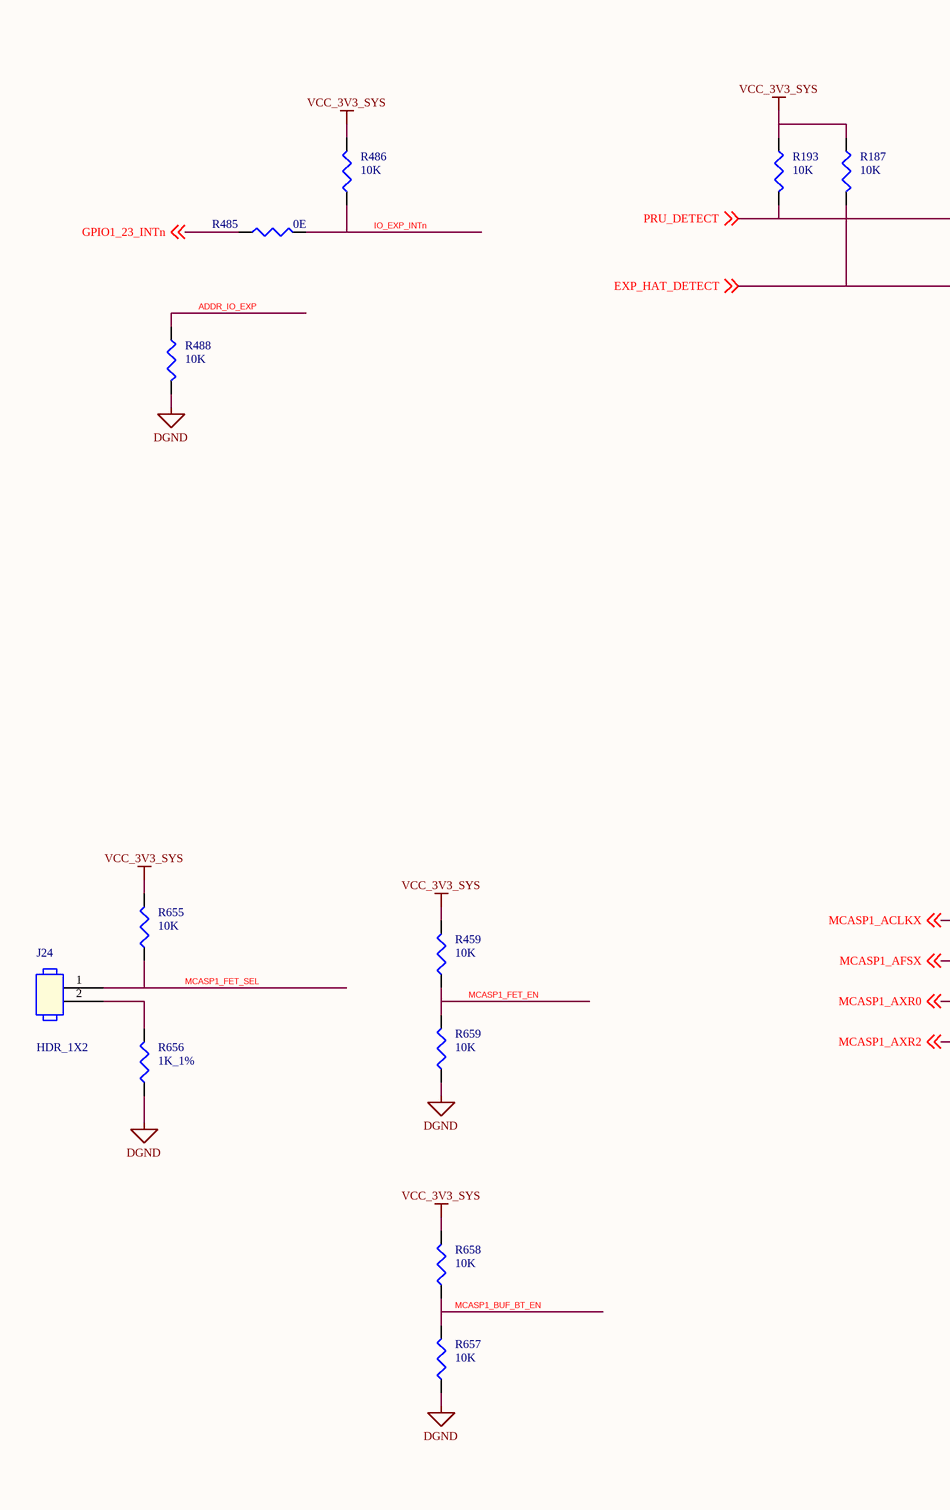
[diagram p69: 39.SchDoc, left]
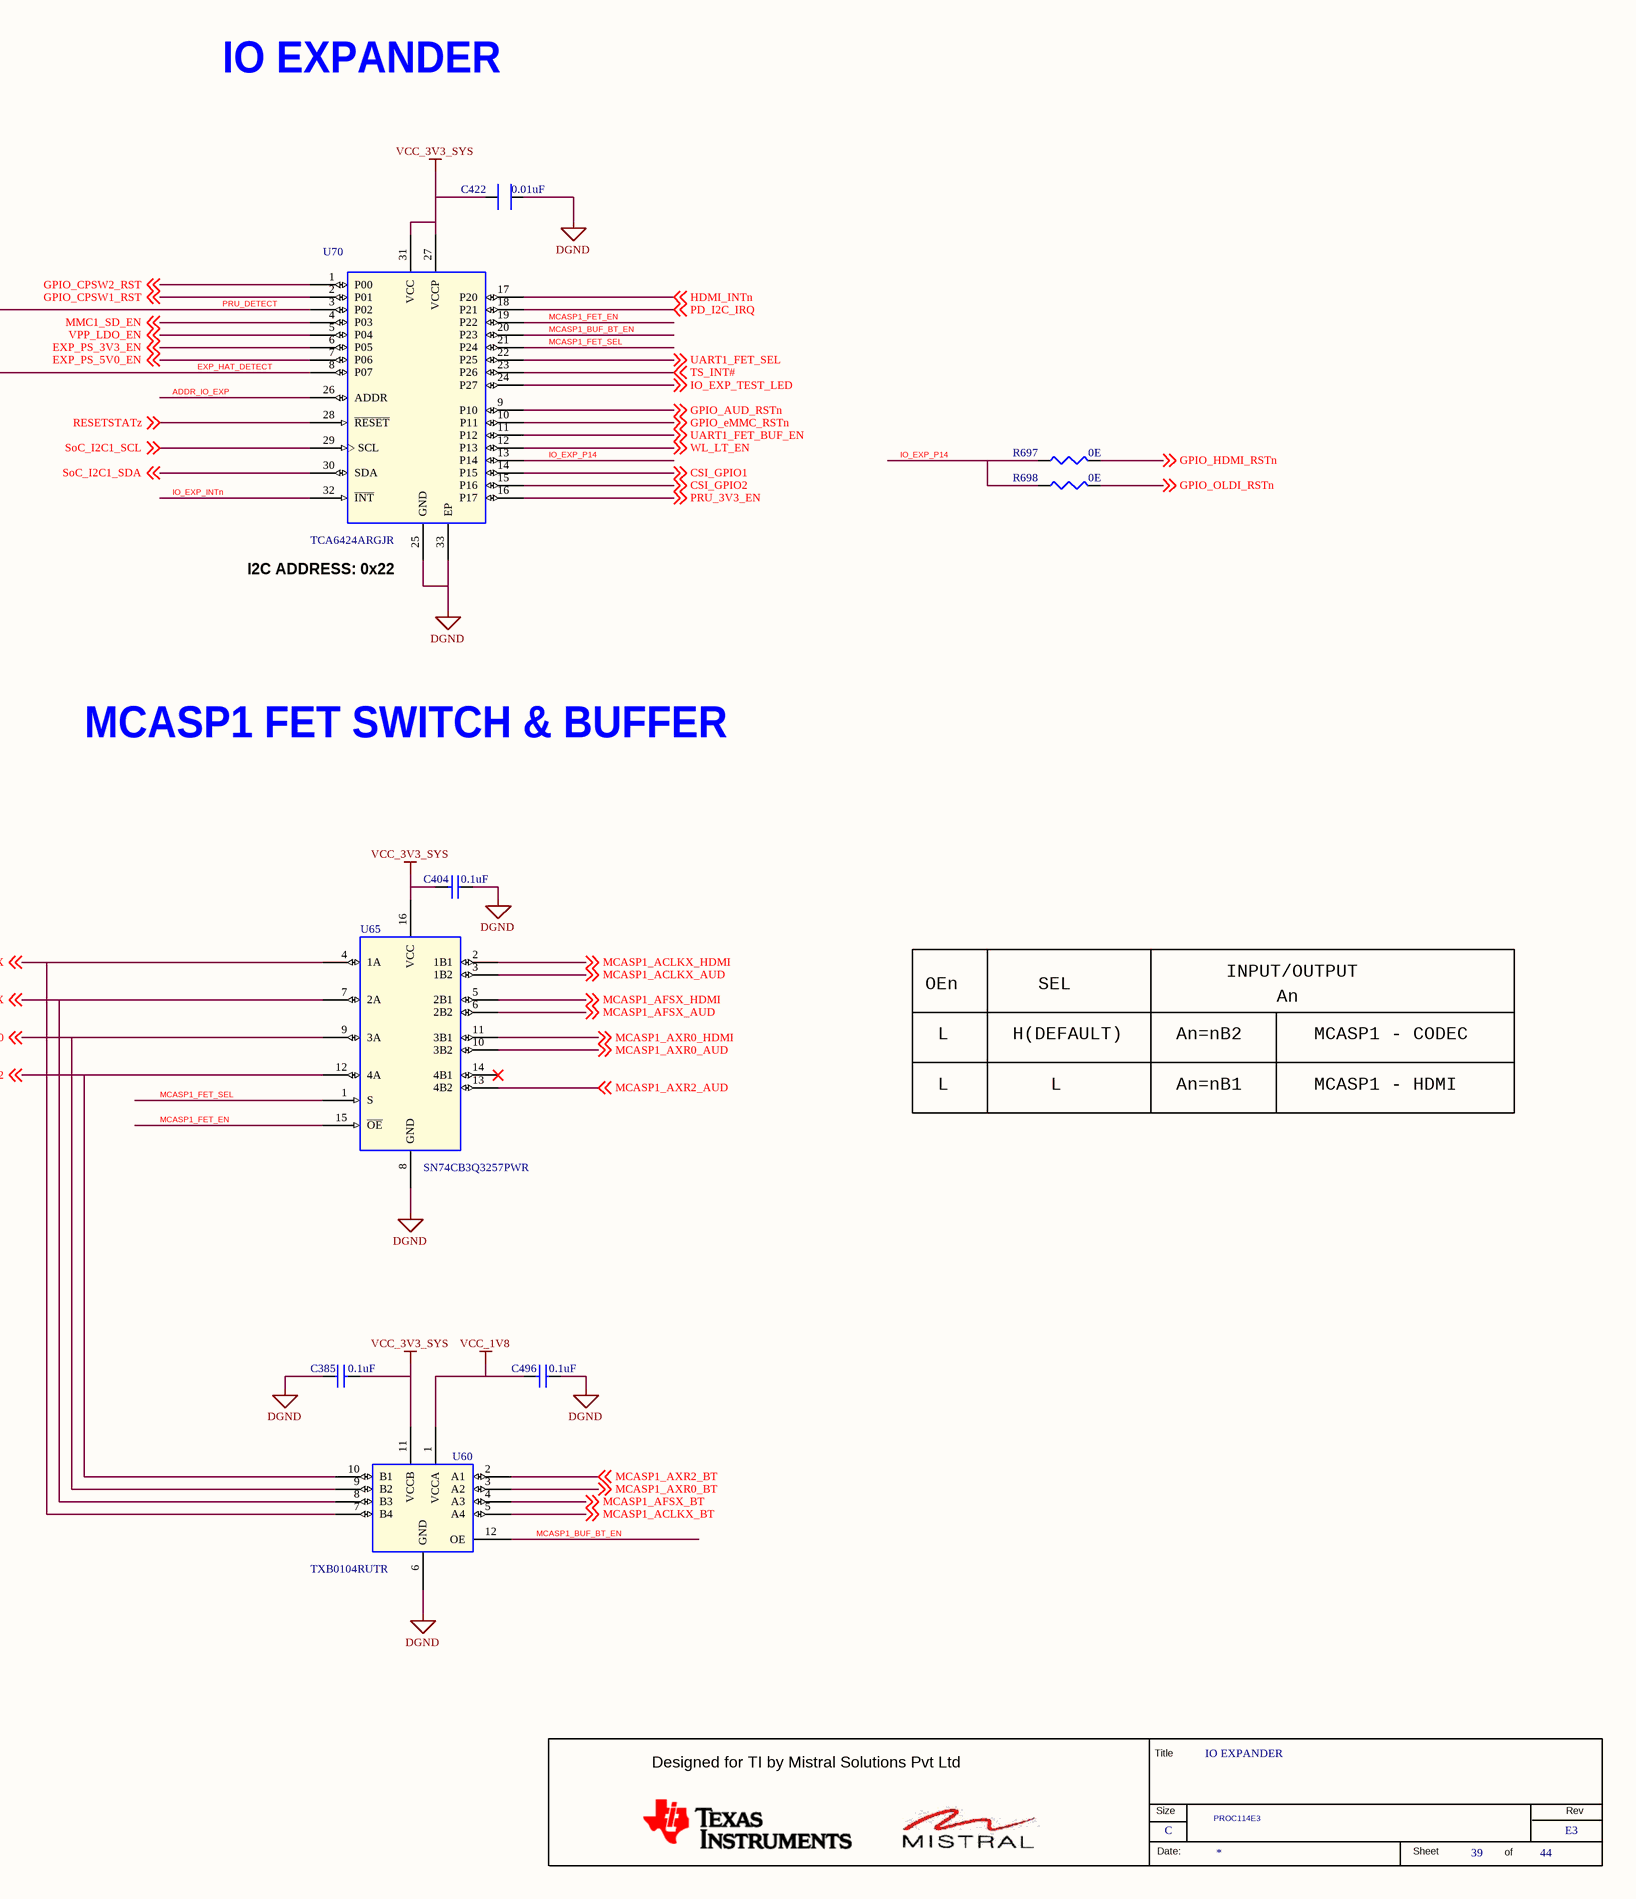
[diagram p70: 39.SchDoc, right]

### Parts
(Parts that share a designator on the sheet are numbered #1, #2 ... from top to bottom, then left to right.)
*#39  RevCode: E3  Title: IO EXPANDER  Page Size: C  Page Number: 39  Page Count: 44  Variant Name: PROC114E3  (hidden comment: MISTRAL_TITLEBLK_CSIZE)  (graphical)
C385  0.1uF  [CAP0201_0-5]
C404  0.1uF  [CAP0201_0-5]
C422  0.01uF  [CAP0402N]
C496  0.1uF  [CAP0201_0-5]
J24  HDR_1X2  [HDR_1X2_90120-0122_S_T_5-6]
R187  10K  [RES0201_0-5]
R193  10K  [RES0201_0-5]
R459  10K  [RES0201_0-5]
R485  0E  [RES0402_0-5]
R486  10K  [RES0201_0-5]
R488  10K  [RES0201_0-5]
R655  10K  [RES0201_0-5]
R656  1K_1%  [RES0402_0-5]
R657  10K  [RES0201_0-5]
R658  10K  [RES0201_0-5]
R659  10K  [RES0201_0-5]
R697  0E  [RES0201_0-5]
R698  0E  [RES0201_0-5]
U60  TXB0104RUTR  [UQFN12_TXB0104RUT_70X80_0-6]
U65  SN74CB3Q3257PWR  [TSSOP16_25-59_205X180]
U70  TCA6424ARGJR  [QFN32_19-68_200X200]

### Nets
DGND: C385.1 C404.1 C422.1 C496.1 R488.1 R656.1 R657.1 R659.1 U60.6(GND) U65.8(GND) U70.25(GND) U70.33(EP)
VCC_1V8: C496.2 U60.1(VCCA)
VCC_3V3_SYS: C385.2 C404.2 C422.2 R187.2 R193.2 R459.2 R486.2 R655.2 R658.2 U60.11(VCCB) U65.16(VCC) U70.27(VCCP) U70.31(VCC)
ADDR_IO_EXP: R488.2 U70.26(ADDR)
CSI_GPIO1: U70.14(P15) ; off-sheet CSI_GPIO1
CSI_GPIO2: U70.15(P16) ; off-sheet CSI_GPIO2
EXP_HAT_DETECT: R187.1 U70.8(P07) ; off-sheet EXP_HAT_DETECT
EXP_PS_3V3_EN: U70.6(P05) ; off-sheet EXP_PS_3V3_EN
EXP_PS_5V0_EN: U70.7(P06) ; off-sheet EXP_PS_5V0_EN
GPIO1_23_INTn: R485.1 ; off-sheet GPIO1_23_INTn
GPIO_AUD_RSTn: U70.9(P10) ; off-sheet GPIO_AUD_RSTn
GPIO_CPSW1_RST: U70.2(P01) ; off-sheet GPIO_CPSW1_RST
GPIO_CPSW2_RST: U70.1(P00) ; off-sheet GPIO_CPSW2_RST
GPIO_eMMC_RSTn: U70.10(P11) ; off-sheet GPIO_eMMC_RSTn
GPIO_HDMI_RSTn: R697.2 ; off-sheet GPIO_HDMI_RSTn
GPIO_OLDI_RSTn: R698.2 ; off-sheet GPIO_OLDI_RSTn
HDMI_INTn: U70.17(P20) ; off-sheet HDMI_INTn
IO_EXP_INTn: R485.2 R486.1 U70.32(~{INT})
IO_EXP_P14: R697.1 R698.1 U70.13(P14)
IO_EXP_TEST_LED: U70.24(P27) ; off-sheet IO_EXP_TEST_LED
MCASP1_ACLKX: U60.7(B4) U65.4(1A) ; off-sheet MCASP1_ACLKX
MCASP1_ACLKX_AUD: U65.3(1B2) ; off-sheet MCASP1_ACLKX_AUD
MCASP1_ACLKX_BT: U60.5(A4) ; off-sheet MCASP1_ACLKX_BT
MCASP1_ACLKX_HDMI: U65.2(1B1) ; off-sheet MCASP1_ACLKX_HDMI
MCASP1_AFSX: U60.8(B3) U65.7(2A) ; off-sheet MCASP1_AFSX
MCASP1_AFSX_AUD: U65.6(2B2) ; off-sheet MCASP1_AFSX_AUD
MCASP1_AFSX_BT: U60.4(A3) ; off-sheet MCASP1_AFSX_BT
MCASP1_AFSX_HDMI: U65.5(2B1) ; off-sheet MCASP1_AFSX_HDMI
MCASP1_AXR0: U60.9(B2) U65.9(3A) ; off-sheet MCASP1_AXR0
MCASP1_AXR0_AUD: U65.10(3B2) ; off-sheet MCASP1_AXR0_AUD
MCASP1_AXR0_BT: U60.3(A2) ; off-sheet MCASP1_AXR0_BT
MCASP1_AXR0_HDMI: U65.11(3B1) ; off-sheet MCASP1_AXR0_HDMI
MCASP1_AXR2: U60.10(B1) U65.12(4A) ; off-sheet MCASP1_AXR2
MCASP1_AXR2_AUD: U65.13(4B2) ; off-sheet MCASP1_AXR2_AUD
MCASP1_AXR2_BT: U60.2(A1) ; off-sheet MCASP1_AXR2_BT
MCASP1_BUF_BT_EN: R657.2 R658.1 U60.12(OE) U70.20(P23)
MCASP1_FET_EN: R459.1 R659.2 U65.15(~{OE}) U70.19(P22)
MCASP1_FET_SEL: J24.1 R655.1 U65.1(S) U70.21(P24)
MMC1_SD_EN: U70.4(P03) ; off-sheet MMC1_SD_EN
PD_I2C_IRQ: U70.18(P21) ; off-sheet PD_I2C_IRQ
PRU_3V3_EN: U70.16(P17) ; off-sheet PRU_3V3_EN
PRU_DETECT: R193.1 U70.3(P02) ; off-sheet PRU_DETECT
RESETSTATz: U70.28(~{RESET}) ; off-sheet RESETSTATz
SoC_I2C1_SCL: U70.29(SCL) ; off-sheet SoC_I2C1_SCL
SoC_I2C1_SDA: U70.30(SDA) ; off-sheet SoC_I2C1_SDA
TS_INT#: U70.23(P26) ; off-sheet TS_INT#
UART1_FET_BUF_EN: U70.11(P12) ; off-sheet UART1_FET_BUF_EN
UART1_FET_SEL: U70.22(P25) ; off-sheet UART1_FET_SEL
VPP_LDO_EN: U70.5(P04) ; off-sheet VPP_LDO_EN
WL_LT_EN: U70.12(P13) ; off-sheet WL_LT_EN
NetJ24_2: J24.2 R656.2

Not connected (* = marked no-connect by the designer): U65 14(4B1)*

### Notes on the sheet
- IO EXPANDER
- (near U70) I2C ADDRESS: 0x22
- MCASP1 FET SWITCH & BUFFER
- OEn
- SEL
- INPUT/OUTPUT
- An
- L
- H(DEFAULT)
- An=nB2
- MCASP1 - CODEC
- An=nB1
- MCASP1 - HDMI
- (in symbol MISTRAL_TITLEBLK_CSIZE) Title; Designed for TI by Mistral Solutions Pvt Ltd; Size; Rev; Date:; Sheet; of

### Library data of the parts
*#39 = MISTRAL_TITLEBLK_CSIZE: Issue: 1.0; Page Create Date: March  8, 1995; Page Modify Date: *; Schematic Page Count: 44; Schematic Page Number: 39
C385 C404 = CAP_Dup2: as C497 on sheet 37; PCB Footprint: CAP0201_0-5; Tolerance: 10%; Voltage: 16V; Package: 0201; Distributor_name: DIGIKEY; Distributor_part_number: 490-14305-1-ND; Height: 0.33MM; Weight: 0.33mg; Temperature: -55°C+85°C; Datasheet: Y:\MIS_DATABASE\DATASHEETS\CAPACITORS\GRM033R61C104KE14.PDF; Crtd /date: MANIRAJA/230118; Chkd/date: MANIRAJA/230118; MECHANICAL 3D STEP FILE: CAP0201_0-5; Library Ref: CAP; Footprint Ref: CAP0201_0-5; Library Path: Y:\MIS_DATABASE\Library\ALTIUM_TOOL\SCHEMATICS_PARTS\MS_DISCRETE_Library.schlib; Footprint Path: Y:\MIS_DATABASE\Library\ALTIUM_TOOL\PCB_FOOTPRINTS\Altium_Footprint_Lib.PcbLib
C422 = CAP_Dup3: CAP CERAMIC 0.01uF 25V 10% X5R 0201; Part_type: CAPACITORS\CERAMIC; Mfr_part_number: GRM033R61E103KA12J; Mfr_name: MURATA; Mistral Part No: 120018010007-R; PCB Footprint: CAP0201_0-5; Wattage: NA; Custom_Duty: 15%; Customs_HS_Code: 85322990; Project: TI_MAXIE_CPB; Footprint Path: Y:\MIS_DATABASE\Library\ALTIUM_TOOL\PCB_FOOTPRINTS\Altium_Footprint_Lib.PcbLib; Library Path: Y:\MIS_DATABASE\Library\ALTIUM_TOOL\SCHEMATICS_PARTS\MS_DISCRETE_Library.schlib; Footprint Ref: CAP0201_0-5; MECHANICAL 3D STEP FILE: CAP0201_0-5; Temperature: -55°C+85°C; Weight: 0.33mg; Chkd/date: MANIRAJA/230118; Crtd /date: MANIRAJA/230118; Datasheet: Y:\MIS_DATABASE\DATASHEETS\CAPACITORS\GRM033R61E103KA12.PDF; Height: 0.33MM; Distributor_part_number: GRM033R61E103KA12J-ND; Distributor_name: DIGIKEY; Package: 0201; Voltage: 25V; Tolerance: 10%; Library Ref: CAP
C496 = CAP_Dup2: as C8 on sheet 37; PCB Footprint: CAP0201_0-5; Footprint Path: Y:\MIS_DATABASE\Library\ALTIUM_TOOL\PCB_FOOTPRINTS\Altium_Footprint_Lib.PcbLib; Library Path: Y:\MIS_DATABASE\Library\ALTIUM_TOOL\SCHEMATICS_PARTS\MS_DISCRETE_Library.schlib; Footprint Ref: CAP0201_0-5; Library Ref: CAP; MECHANICAL 3D STEP FILE: CAP0201_0-5; Chkd/date: MANIRAJA/230118; Crtd /date: MANIRAJA/230118; Datasheet: Y:\MIS_DATABASE\DATASHEETS\CAPACITORS\GRM033R61C104KE14.PDF; Temperature: -55°C+85°C; Weight: 0.33mg; Height: 0.33MM; Distributor_part_number: 490-14305-1-ND; Distributor_name: DIGIKEY; Package: 0201; Voltage: 16V; Tolerance: 10%
J24 = HEADER_2X1: CON HDR 1X2 2.54MM PITCH ST TH; Part_type: CONNECTOR\HEADERS; Mfr_part_number: 90120-0122; Mfr_name: MOLEX; Mistral Part No: 150012100005-R; Custom_Duty: 24%; Customs_HS_Code: 85369090; Project: NPOL_FEP; Tolerance: NA; Chkd/date: NAVEED/210714; Crtd /date: USMAN/031012; Datasheet: Y:\MIS_DATABASE\DATASHEETS\CONNECTORS\90120-XX.PDF; Height: 5.60MM; Distributor_part_number: WM8072-ND; Distributor_name: DIGIKEY; Package: THRU-HOLE; Voltage: NA; Wattage: NA; Weight: 122mg; Temperature: -55°C+125°C; MECHANICAL 3D STEP FILE: HDR_1X2_90120-0122_S_T_5-6; Library Path: Y:\MIS_DATABASE\Library\ALTIUM_TOOL\SCHEMATICS_PARTS\MS_CONNECTOR_Library.schlib; Footprint Path: Y:\MIS_DATABASE\Library\ALTIUM_TOOL\PCB_FOOTPRINTS\Altium_Footprint_Lib.PcbLib; Library Ref: HEADER_2X1; Footprint Ref: HDR_1X2_90120-0122_S_T_5-6; PCB Footprint: HDR_1X2_90120-0122_S_T_5-6
R187 R193 R486 R488 = RESISTOR_Dup6: as R16 on sheet 37; PCB Footprint: RES0201_0-5; MECHANICAL 3D STEP FILE: RES0201_0-5; Chkd/date: MANIRAJA/050517; Crtd /date: MANIRAJA/050517; Datasheet: Y:\MIS_DATABASE\DATASHEETS\RESISTORS\RCXXXXL-SER_MAR18.PDF; Temperature: -55°C+125°C; Weight: 0.17mg; Height: 0.26MM; Distributor_part_number: 311-10KNCT-ND; Distributor_name: DIGIKEY; Package: 0201; Wattage: 1/20W; Tolerance: 5%; Library Ref: RESISTOR; Footprint Ref: RES0201_0-5; Library Path: Y:\MIS_DATABASE\Library\ALTIUM_TOOL\SCHEMATICS_PARTS\MS_DISCRETE_Library.schlib; Footprint Path: Y:\MIS_DATABASE\Library\ALTIUM_TOOL\PCB_FOOTPRINTS\Altium_Footprint_Lib.PcbLib
R459 R655 R657-R659 = RESISTOR_Dup6: as R176 on sheet 37; Footprint Path: Y:\MIS_DATABASE\Library\ALTIUM_TOOL\PCB_FOOTPRINTS\Altium_Footprint_Lib.PcbLib; Library Path: Y:\MIS_DATABASE\Library\ALTIUM_TOOL\SCHEMATICS_PARTS\MS_DISCRETE_Library.schlib; Footprint Ref: RES0201_0-5; Library Ref: RESISTOR; Tolerance: 5%; Wattage: 1/20W; Package: 0201; Distributor_name: DIGIKEY; Distributor_part_number: 311-10KNCT-ND; Height: 0.26MM; Weight: 0.17mg; Temperature: -55°C+125°C; Datasheet: Y:\MIS_DATABASE\DATASHEETS\RESISTORS\RCXXXXL-SER_MAR18.PDF; Crtd /date: MANIRAJA/050517; Chkd/date: MANIRAJA/050517; MECHANICAL 3D STEP FILE: RES0201_0-5; PCB Footprint: RES0201_0-5
R485 = RESISTOR_Dup6: RES 0E 1/16W JUMPER 0402; Mistral Part No: 110010080019-R; Mfr_name: VISHAY; Mfr_part_number: CRCW04020000Z0ED; Part_type: RESISTORS\FIXED; Project: PB_BUGBASE; Tolerance: NA; Customs_HS_Code: 85332119; Custom_Duty: 15%; PCB Footprint: RES0402_0-5; Footprint Ref: RES0402_0-5; Voltage: NA; Wattage: 1/16W; Package: 0402; Distributor_name: DIGIKEY; Distributor_part_number: 541-0.0JCT-ND; Library Ref: RESISTOR; Height: 0.40MM; Weight: 0.65mg; Temperature: -55°C+155°C; Datasheet: Y:\MIS_DATABASE\DATASHEETS\RESISTORS\CRCW0603.PDF; Crtd /date: MUDDU/190810; Chkd/date: VASANTHA/201216; MECHANICAL 3D STEP FILE: RES0402_0-5; Library Path: Y:\MIS_DATABASE\Library\ALTIUM_TOOL\SCHEMATICS_PARTS\MS_DISCRETE_Library.schlib; Footprint Path: Y:\MIS_DATABASE\Library\ALTIUM_TOOL\PCB_FOOTPRINTS\Altium_Footprint_Lib.PcbLib
R656 = RESISTOR_Dup4: RES 1K 1/10W 1% 0402; Part_type: RESISTORS\FIXED; Mfr_part_number: ERJ-2RKF1001X; Mfr_name: PANASONIC-ECG; Mistral Part No: 110009030411-R; Custom_Duty: 15%; Customs_HS_Code: 85332119; Voltage: NA; Project: VOCERA; PCB Footprint: RES0402_0-5; Chkd/date: VASANTHA/281216; Crtd /date: MAZHAR/150506; Datasheet: Y:\MIS_DATABASE\DATASHEETS\RESISTORS\PAN-ERJSER_NOV17.PDF; Temperature: -55°C+155°C; Weight: 0.8mg; Height: 0.40MM; Distributor_part_number: P1.00KLCT-ND; Distributor_name: DIGIKEY; Package: 0402; Wattage: 1/10W; Tolerance: 1%; Library Ref: RESISTOR; Footprint Ref: RES0402_0-5; MECHANICAL 3D STEP FILE: RES0402_0-5; Library Path: Y:\MIS_DATABASE\Library\ALTIUM_TOOL\SCHEMATICS_PARTS\MS_DISCRETE_Library.schlib; Footprint Path: Y:\MIS_DATABASE\Library\ALTIUM_TOOL\PCB_FOOTPRINTS\Altium_Footprint_Lib.PcbLib
R697 R698 = RESISTOR_Dup6: RES 0E 1/20W 5% 0201; Part_type: RESISTORS\FIXED; Mfr_part_number: RC0201JR-070RL; Mfr_name: YAGEO AMERICA; Mistral Part No: 110010070067-R; Custom_Duty: 15%; Customs_HS_Code: 85332119; Voltage: NA; Project: PB_BUGBASE; Footprint Path: Y:\MIS_DATABASE\Library\ALTIUM_TOOL\PCB_FOOTPRINTS\Altium_Footprint_Lib.PcbLib; Library Path: Y:\MIS_DATABASE\Library\ALTIUM_TOOL\SCHEMATICS_PARTS\MS_DISCRETE_Library.schlib; MECHANICAL 3D STEP FILE: RES0201_0-5; Chkd/date: NAVEED/301214; Crtd /date: MUDDU/120710; Datasheet: Y:\MIS_DATABASE\DATASHEETS\RESISTORS\RCXXXXL-SER_MAR18.PDF; Temperature: -55°C+125°C; Weight: 0.17mg; Height: 0.26MM; Library Ref: RESISTOR; Distributor_part_number: 311-0.0NCT-ND; Distributor_name: DIGIKEY; Package: 0201; Wattage: 1/20W; Tolerance: 5%; Footprint Ref: RES0201_0-5; PCB Footprint: RES0201_0-5
U60 = TXB0104RUTR_UQFN12: IC 4-BIT BIDIRECTIONAL VOLTAGE-LEVEL TRANSLATOR UQFN12; Mistral Part No: 141017110007-R; Manufacturer: TEXAS INSTRUMENTS; Part_type: ICS\INTERFACE\LEVEL TRANSLATOR; Project: RSAPR_TYPE-II_3U-SBC; Tolerance: NA; Customs_HS_Code: 85423100; Custom_Duty: 15%; Mfr_part_number: TXB0104RUTR; Voltage: NA; Wattage: NA; Package: UQFN12; Distributor_name: DIGIKEY; Distributor_part_number: 296-25888-1-ND; Library Ref: TXB0104RUTR_UQFN12; Height: 0.55MM; Weight: 4.70mg; Temperature: -40°C+85°C; Datasheet: Y:\MIS_DATABASE\DATASHEETS\ICS\INTERFACE\TXB0104.PDF; Crtd /date: ALVY/271117; Chkd/date: MANIRAJA/281117; MECHANICAL 3D STEP FILE: UQFN12_TXB0104RUT_70X80_0-6; PCB Footprint: UQFN12_TXB0104RUT_70X80_0-6
U65 = SN74CB3Q3257PWR_TSSOP16: IC 4BIT 1-OF-2 FET MULTIPLEXER/DEMULTIPLEXER TSSOP16; Mistral Part No: 141009030117-R; Manufacturer: TEXAS INSTRUMENTS; Part_type: ICS\DIGITAL\COMBINATIONAL; Project: OMAP_EVM; Customs_HS_Code: 85423100; Custom_Duty: 15%; PCB Footprint: TSSOP16_25-59_205X180; Mfr_part_number: SN74CB3Q3257PWR; Package: TSSOP16; Distributor_name: DIGIKEY; Distributor_part_number: 296-19138-1-ND; Library Ref: SN74CB3Q3257PWR_TSSOP16; Height: 1.20MM; Temperature: -40°C+85°C; Datasheet: Y:\MIS_DATABASE\DATASHEETS\ICS\DIGITAL\COMBINATIONAL\SN74CB3Q3257.PDF; Crtd /date: USMAN/060109; Chkd/date: SUHAS/251010; RoHS: Sb/ Br FREE
U70 = TCA6424ARGJR_QFN32: IC I2C I/O EXPANDER 24B UQFN32; Mistral Part No: 141014090009-R; Mfr_name: TEXAS INSTRUMENTS; Part_type: ICS\DIGITAL\BUSTRANSCEIVER; Project: ZK_BIOMETRIC; Customs_HS_Code: 85423100; Custom_Duty: 15%; PCB Footprint: QFN32_19-68_200X200; Mfr_part_number: TCA6424ARGJR; Package: UQFN32; Distributor_name: DIGIKEY; Distributor_part_number: 296-27844-1-ND; Library Ref: TCA6424ARGJR_QFN32; Height: 0.60MM; Weight: NA; Temperature: -40°C+85°C; Datasheet: Y:\MIS_DATABASE\DATASHEETS\ICS\DIGITAL\BUSTRANSCEIVER\TCA6424AR.PDF; Crtd /date: NAVEED/100914; Chkd/date: NAVEED/100715